# Altium project SMART_HOME_FINAL.PrjPcb
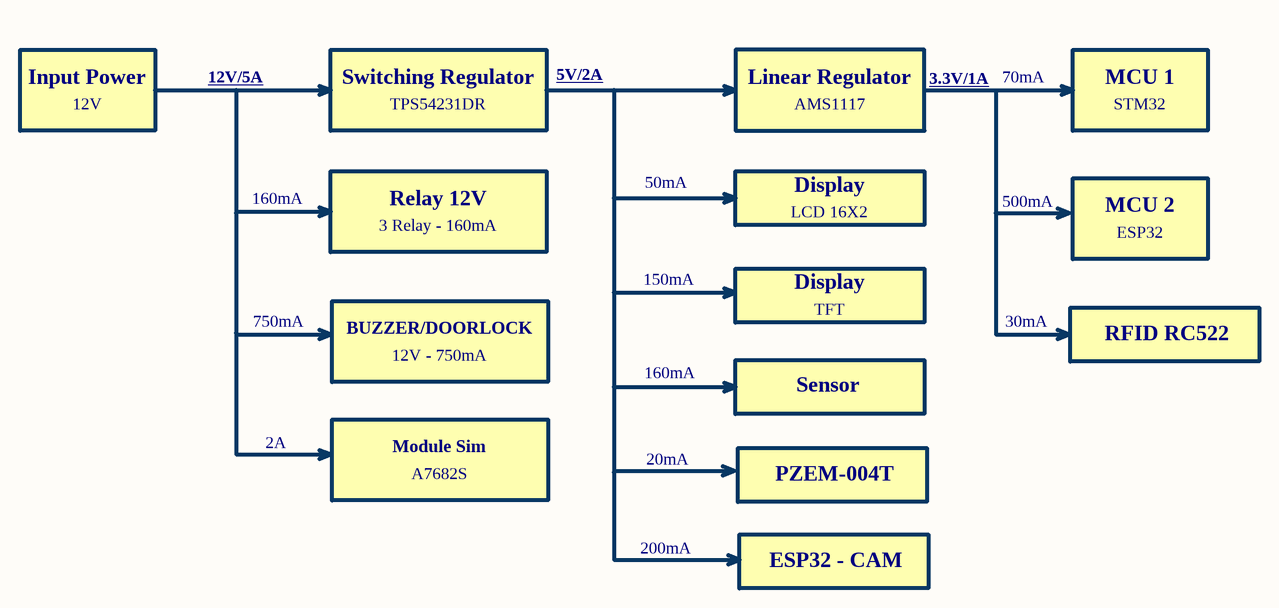
[diagram p0: POWER DIAGRAM.SchDoc]
5 sheets, 146 parts. Net scope: global (net labels, ports and power ports of the same name join across sheets).
Board file: BOARD.PcbDoc
Sheets:
  POWER DIAGRAM.SchDoc
  POWER SUPPLY.SchDoc
  BLOCK DIAGRAM.SchDoc
  MCU.SchDoc
  DEVICE.SchDoc

## Sheet POWER DIAGRAM.SchDoc
size A3; SheetNumber: 1; SheetTotal: 5

### Notes on the sheet
- Input Power
- 12V/5A
- Switching Regulator
- 5V/2A
- Linear Regulator
- 3.3V/1A
- 70mA
- MCU 1
- 12V
- TPS54231DR
- AMS1117
- STM32
- 160mA
- Relay 12V
- 3 Relay - 160mA
- 50mA
- Display
- LCD 16X2
- 500mA
- MCU 2
- ESP32
- 150mA
- 750mA
- BUZZER/DOORLOCK
- 12V - 750mA
- TFT
- 30mA
- RFID RC522
- Sensor
- 2A
- Module Sim
- A7682S
- 20mA
- PZEM-004T
- 200mA
- ESP32 - CAM

## Sheet POWER SUPPLY.SchDoc
size A3; SheetNumber: 2; SheetTotal: 5
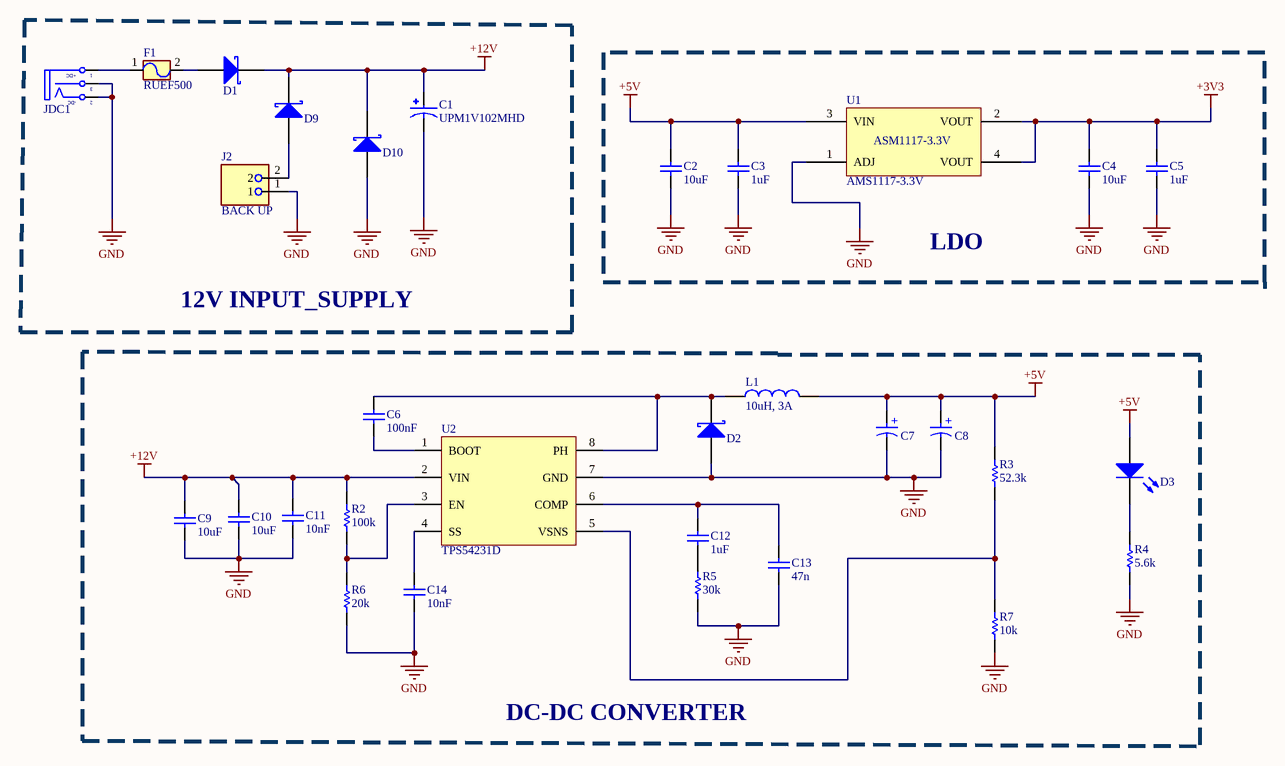
[diagram p1: POWER SUPPLY.SchDoc]

### Parts
C1  UPM1V102MHD  [CAPPRD500W80D1250H3350]
C2  10uF  [CAP_0603]
C3  1uF  [CAP_0603]
C4  10uF  [CAP_0603]
C5  1uF  [CAP_0603]
C6  100nF  [CAP_0603]
C7  47uF  [WCAP-ASLI_D5H5.5]  (value not drawn)
C8  47uF  [WCAP-ASLI_D5H5.5]  (value not drawn)
C9  10uF  [CAP_0603]
C10  10uF  [CAP_0603]
C11  10nF  [CAP_0603]
C12  1uF  [CAP_0603]
C13  47n  [CAP_0603]
C14  10nF  [CAP_0603]
D1  D Schottky  [SS34]  (value not drawn)
D2  D Schottky  [SS34]  (value not drawn)
D3  LED SMD  [LED_0805_Blue]  (value not drawn)
D9  D Schottky  [SS34]  (value not drawn)
D10  D Schottky  [SS34]  (value not drawn)
F1  RUEF500  [RUEF400]
J2  BACK UP  [PHOENIX_1935161]
JDC1  Jack DC  [DC-IN]  (value not drawn)
L1  10uH, 3A  [WE-PD2A_5848]
R2  100k  [resistor_0603]
R3  52.3k  [resistor_0603]
R4  5.6k  [resistor_0603]
R5  30k  [resistor_0603]
R6  20k  [resistor_0603]
R7  10k  [resistor_0603]
U1  AMS1117-3.3V  [AMS1117-3.3V SOT223]
U2  TPS54231D  [SOIC8]

### Blocks framed on the sheet
12V INPUT_SUPPLY: C1 D1 D9 D10 F1 J2 JDC1
DC-DC CONVERTER: C6-C14 D2 D3 L1 R2-R7 U2

### Nets
+3V3: C4.2 C5.2 U1.2(VOUT) U1.4(VOUT)
+5V: C2.2 C3.2 C7.1(P) C8.1(P) D3.1(A) L1.2 R3.2 U1.3(VIN)
+12V: C1.P C9.2 C10.2 C11.2 D1.2(K) D9.2(K) D10.2(K) R2.2 U2.2(VIN)
GND: C1.N C2.1 C3.1 C4.1 C5.1 C7.2(N) C8.2(N) C9.1 C10.1 C11.1 C13.1 C14.1 D2.1(A) D10.1(A) J2.1 JDC1.2(TN) JDC1.3(S) R4.1 R5.1 R6.1 R7.1 U1.1(ADJ) U2.7(GND)
NetC6_1: C6.1 U2.1(BOOT)
NetC6_2: C6.2 D2.2(K) L1.1 U2.8(PH)
NetC12_1: C12.1 C13.2 U2.6(COMP)
NetC12_2: C12.2 R5.2
NetC14_2: C14.2 U2.4(SS)
NetD1_1: D1.1(A) F1.2
NetD3_2: D3.2(K) R4.2
NetD9_1: D9.1(A) J2.2
NetF1_1: F1.1 JDC1.1(T)
NetR2_1: R2.1 R6.2 U2.3(EN)
NetR3_1: R3.1 R7.2 U2.5(VSNS)

### Notes on the sheet
- LDO
- Title:
- Desc:
- Designed by:
- Checked by:
- Date:
- Document No:
- Revision:
- Size:
- A3
- Approved by:
- Sheet
- of
- (in symbol 865080342006) +
- (in symbol AMS1117-3.3V) ASM1117-3.3V
- (in symbol Jack DC) +DC; -DC

### Library data of the parts
C1 = UPM1V102MHD: CAPACITOR ALUM ELECT 1000UF, 35V, RADIAL; Capacitance:1000ÂµF; Capacitance Tolerance:Â± 20%; Voltage Rating:35V; Life Time @ Temperature:5000 hours @ 105Â°C; Height:31.5mm; Diameter:12.5mm; Capacitor Mounting:Through Hole; MF: Nichicon; Purchase-URL: https://pricing.snapeda.com/search/part/UPM1V102MHD/?ref=eda; Package: Radial Nichicon; Availability: Warning; Value: *; MP: UPM1V102MHD; Price: None; SnapEDA_Link: https://www.snapeda.com/parts/UPM1V102MHD/Nichicon/view-part/775133/?ref=snap; Check_prices: https://www.snapeda.com/parts/UPM1V102MHD/Nichicon/view-part/775133/?ref=eda
C2 C4 C12 = 01060310510: CAP, size 0603, 1uF; Supply 1 SN: 885012206126; Supply 1 name: Wurth Elektronik; Supply 2 name: Thegioiic; Capacitance Tolerance: +/-10%; ComponentLink1Description: Manufacturer; ComponentLink1URL: http://www.we-online.de; ComponentLink2Description: Datasheet; ComponentLink2URL: https://www.we-online.com/components/products/datasheet/885012206126.pdf; Operating Temperature: -55 to +125degC; Packaging: Tape and Reel; Supply 1 URL: https://www.we-online.com/en/components/products/WCAP-CSGP-50VDC?sq=885012206126#885012206126; Supply 2 SN: *; Supply 2 URL: https://www.thegioiic.com/tu-gom-0603-1uf-50v; Dissipation Factor: *; Height: *; Mounting Technology: SMT; Size: 0603; Capacitance: 1uF; Technical Reference: *
C3 C5 C6 = 01060310410: CAP, size 0603, 100nF; Supply 1 SN: 885012206095; Supply 1 name: Wurth Elektronik; Supply 2 name: Thegioiic; Capacitance Tolerance: +/-10%; ComponentLink1Description: Manufacturer; ComponentLink1URL: http://www.we-online.de; ComponentLink2Description: Datasheet; ComponentLink2URL: https://www.we-online.com/catalog/datasheet/885012206095.pdf; Operating Temperature: -55 to +125degC; Packaging: Tape and Reel; Supply 1 URL: https://www.we-online.com/en/components/products/WCAP-CSGP-50VDC?sq=885012206095R#885012206095R; Supply 2 SN: *; Supply 2 URL: https://www.thegioiic.com/tu-gom-0603-100nf-0-1uf-50v; Dissipation Factor: *; Height: *; Mounting Technology: SMT; Size: 0603; Capacitance: 100nF; Technical Reference: *
C7 C8 = 865080342006: V-Chip, D5 x H5.5mm, 47uF, 16V; Capacitance Tolerance: +/-20%; Dissipation Factor: 16%; Endurance: 2000h; Leakage Current: 7.52uA; Ripple Current: 195mA; Supply 1 Name: Mouser; Supply 1 SN: 710-865080262015; Supply 2 Name: thegioiic; Category: Aluminum Electrolytic Capacitors; ComponentLink2Description: Datasheet Link; ComponentLink2URL: https://www.we-online.com/redexpert/spec/865080342006?ad; Mount: Surface Mount; Operating Temperature Max: 105°C; Operating Temperature Min: -55°C; Packaging: Tape and Reel; Height: 5.5mm; Diameter: 5mm; Capacitance: 47uF; Rated Voltage (DC): 16V; Supply 1 URL: https://www.mouser.com/ProductDetail/Wurth-Elektronik/865080262015?qs=0KOYDY2FL2%2Ffe5w2MssUoQ%3D%3D; Supply 2 URL: https://www.thegioiic.com/tu-nhom-smd-47uf-16v-5x5-4mm
C9 C10 = 01060310010: CAP, size 0603,10uF; Supply 2 name: Thegioiic; Capacitance Tolerance: +/-10%; ComponentLink1Description: Manufacturer; ComponentLink1URL: *; ComponentLink2Description: Datasheet; ComponentLink2URL: *; Operating Temperature: -55 to +125degC; Packaging: Tape and Reel; Supply 1 SN: *; Supply 1 name: *; Supply 1 URL: *; Supply 2 SN: *; Supply 2 URL: https://www.thegioiic.com/tu-gom-0603-10uf-16v; Dissipation Factor: *; Height: *; Mounting Technology: SMT; Size: 0603; Capacitance: 10uF; Technical Reference: *
C11 C14 = 01060310310: CAP, size 0603, 10nF; Supply 1 SN: 885012206089; Supply 1 name: Wurth Elektronik; Supply 2 name: Thegioiic; Capacitance Tolerance: +/-10%; ComponentLink1Description: Manufacturer; ComponentLink1URL: http://www.we-online.de; ComponentLink2Description: Datasheet; ComponentLink2URL: https://www.we-online.com/catalog/datasheet/885012206089.pdf; Operating Temperature: -55 to +125degC; Packaging: Tape and Reel; Supply 1 URL: https://www.we-online.com/en/components/products/WCAP-CSGP-50VDC?sq=885012206089#885012206089; Supply 2 SN: *; Supply 2 URL: https://www.thegioiic.com/tu-gom-0603-10nf-50v; Dissipation Factor: *; Height: *; Mounting Technology: SMT; Size: 0603; Capacitance: 10nF; Technical Reference: *
C13 = 01060347310: CAP, size 0603, 47nF; Supply 1 SN: 885012206093; Supply 1 name: Wurth Elektronik; Supply 2 name: Thegioiic; Capacitance Tolerance: +/-10%; ComponentLink1Description: Manufacturer; ComponentLink1URL: http://www.we-online.de; ComponentLink2Description: Datasheet; ComponentLink2URL: https://www.we-online.com/catalog/datasheet/885012206093.pdf; Operating Temperature: -55 to +125degC; Packaging: Tape and Reel; Supply 1 URL: https://www.we-online.com/en/components/products/WCAP-CSGP-50VDC?sq=885012206093#885012206093; Supply 2 SN: *; Supply 2 URL: https://www.thegioiic.com/tu-gom-0603-47nf-50v; Dissipation Factor: *; Height: *; Mounting Technology: SMT; Size: 0603; Capacitance: 47nF; Technical Reference: *
D1 D9 D10 = D Schottky: Schottky Diode SS54A; Published: 8-Jun-2000; LatestRevisionDate: 17-Jul-2002; LatestRevisionNote: Re-released for DXP Platform.; PackageReference: SMB; Publisher: Altium Limited; PackageDescription: DO-214-AA/SMB; 2 C-Bend Leads; Body 5.3 x 3.6 mm, inc. leads (LxW); Code_JEDEC: DO-214-AA
D2 = D Schottky: Schottky Diode; Published: 8-Jun-2000; LatestRevisionDate: 17-Jul-2002; LatestRevisionNote: Re-released for DXP Platform.; PackageReference: SMB; Publisher: Altium Limited; PackageDescription: DO-214-AA/SMB; 2 C-Bend Leads; Body 5.3 x 3.6 mm, inc. leads (LxW); Code_JEDEC: DO-214-AA
D3 = LED SMD: LED
F1 = RUEF500: Polymeric PTC Resettable Fuse 30V 5 A Ih Through Hole Radial, Disc; MF: Littelfuse; SnapEDA_Link: https://www.snapeda.com/parts/RUEF500/Littelfuse/view-part/?ref=snap; Package: Radial Littelfuse; Value: *; MP: RUEF500; Check_prices: https://www.snapeda.com/parts/RUEF500/Littelfuse/view-part/?ref=eda
J2 = Domino: PCB Terminal Screw 5mm 16AWG 400V 17.5A 2 Position COMBICON PT Series | Phoenix Contact 1935161; SnapEDA_Link: https://www.snapeda.com/parts/1935161/Phoenix+Contact/view-part/?ref=snap; Package: None; Value: *; MF: Phoenix Contact; MP: 1935161; Check_prices: https://www.snapeda.com/parts/1935161/Phoenix+Contact/view-part/?ref=eda
JDC1 = Jack DC: Jack DC input; Value: Jac DC
L1 = 78477410: WE-PD2A SMT Power Inductor, size 5848, 10uH, 2.2A; Manufacturer: Wurth Elektronik; DC Resistance max.: 0.1Ohm; Saturation Current: 2.5A; Self Resonant Frequency: 26MHz; DC Resistance typ.: 0.078Ohm; Rated Voltage: 80VDC; Supply 1 Name: Digi-Key; Supply 1 SN: 732-6830-2-ND; Supply 2 Name: Mouser; Supply 2 SN: 710-78477410; Supply 3 Name: thegioiic; ComponentLink1Description: Manufacturer; ComponentLink1URL: http://www.we-online.de; ComponentLink2Description: Datasheet; ComponentLink2URL: https://www.we-online.com/catalog/datasheet/78477410.pdf; Manufacturer Part Number: 78477410; Published Date: May 2020; Rated Current: 2.2A; Inductance: 10uH; Operating Temperature: -40 to +125degC; Mounting Technology: SMT; Packaging: Tape and Reel; Size: 5848; Supply 1 URL: https://www.digikey.com/en/products/detail/w%C3%BCrth-elektronik/78477410/5168779?s=N4IgTCBcDaIOwA4Asc5IIwAYQF0C%2BQA; Supply 2 URL: https://www.mouser.vn/ProductDetail/Wurth-Elektronik/78477410?qs=sBf%2Fb4nBSldlX6CYaJExDg%3D%3D; Supply 3 URL: https://www.thegioiic.com/cuon-cam-dan-smd-cd53-5852-100-10uh-1-8a
R2 = 0006031041: RES, 100k Ohm, size 0603, 1%; Resistance Tolerant: +/-1%; Rated Power: 1/4W; Supply 1 Name: Mouser; Supply 1 SN: 603-SR0603FR-7T100KL; Supply 2 Name: Digikey; Supply 2 SN: YAG5821TR-ND YAG5821CT-ND YAG5821DKR-ND; Resistance: 100k; Size: 0603; Mounting Technology: SMT; ComponentLink1Description: Datasheet link; ComponentLink1URL: https://www.yageo.com/upload/media/product/productsearch/datasheet/rchip/PYu-SR_20105_RoHS_L_10.pdf; ComponentLink2Description: Supply 1 URL; ComponentLink2URL: https://www.mouser.vn/ProductDetail/YAGEO/SR0603FR-7T100KL?qs=sGAEpiMZZMvdGkrng054tz1y1XEHv7sNa%252BA%2F4WiDMf7aGw4zRBb%2FFQ%3D%3D; ComponentLink3Description: Supply 2 URL; ComponentLink3URL: https://www.digikey.com/en/products/detail/yageo/SR0603FR-7T100KL/9373095
R3 = 0006038251: RES, 52.3 kOhms, size 0603, 1%; Resistance tolerance: +/-1%; Rated Power: 1/4 W; Resistance: 8.2K; Supply 1 Name: Mouser; Supply 1 SN: 660-HV731JTTD8204F; Supply 2 Name: Digi-Key; Supply 2 SN: 13-RC0603FR-078M2LTR-ND; Size: 0603; Mounting Technology: SMT; ComponentLink1Description: Datasheet link; ComponentLink1URL: *; Supply 1 URL: https://www.mouser.vn/ProductDetail/KOA-Speer/HV731JTTD8204F?qs=ZqVPfSd1khqN0teaqWW7DA%3D%3D; Supply 2 URL: https://www.digikey.com/en/products/detail/yageo/RC0603FR-078M2L/5918418; Supply 3 Name: *; Supply 3 SN: *
R4 = 0006035621: RES, 5.6k Ohm, size 0603, 1%; Resistance Tolerant: +/-1%; Rated Power: 1/4W; Supply 1 Name: Mouser; Supply 1 SN: 667-ERJ-UP3F5601V; Supply 2 Name: Digikey; Supply 2 SN: 10-ERJ-UP3F5601VTR-ND 10-ERJ-UP3F5601VCT-ND 10-ERJ-UP3F5601VDKR-ND; Resistance: 5.6k; Size: 0603; Mounting Technology: SMT; ComponentLink1Description: Datasheet link; ComponentLink1URL: https://api.pim.na.industrial.panasonic.com/file_stream/main/fileversion/4484; ComponentLink2Description: Supply 1 URL; ComponentLink2URL: https://www.mouser.vn/ProductDetail/Panasonic/ERJ-UP3F5601V?qs=sGAEpiMZZMvdGkrng054twq3eZrCFN89ezYxgAsnxBTZYD17cS%252B65A%3D%3D; ComponentLink3Description: Supply 2 URL; ComponentLink3URL: https://www.digikey.com/en/products/detail/panasonic-electronic-components/ERJ-UP3F5601V/12092890
R5 = 0006033205: RES, 30k Ohm, size 0603, 1%; Resistance tolerance: +/-1%; Rated Power: 1/4 W; Size: 0603; Mounting Technology: SMT; Datasheet: *; Resistance: 30k; ComponentLink1Description: Datasheet link; ComponentLink1URL: *; Supply 1 Name: *; Supply 1 SN: *; Supply 1 URL: *; Supply 2 Name: *; Supply 2 SN: *; Supply 2 URL: *; Supply 3 Name: *; Supply 3 SN: *; Supply 3 URL: *; Manufacture  Name: *; Manufacture  SN: *
R6 = 0006032031: RES, 20 kOhms, size 0603, 1%; Resistance tolerance: +/-1%; Rated Power: 1/4 W; Supply 1 Name: Mouser; Supply 1 SN: 667-ERJ-S03F2002V; Supply 2 Name: Digi-Key; Supply 2 SN: 13-RC0603FR-1320KLTR-ND; Size: 0603; Mounting Technology: SMT; Resistance: 20 k; ComponentLink1Description: Datasheet link; ComponentLink1URL: *; Supply 1 URL: https://www.mouser.vn/ProductDetail/Panasonic/ERJ-S03F2002V?qs=Zyl8A9hlmJopfTdqNIDujw%3D%3D; Supply 2 URL: https://www.digikey.com/en/products/detail/yageo/RC0603FR-1320KL/13694225; Supply 3 Name: *; Supply 3 SN: *
R7 = 0006031521: RES, 1.5 kOhms, size 0603, 1%; Resistance tolerance: +/-1%; Rated Power: 1/4 W; Resistance: 1.5 k; Supply 1 Name: Mouser; Supply 1 SN: 755-SFR03EZPF1501; Supply 2 Name: Digi-Key; Supply 2 SN: 13-RC0603FR-071R5LTR-ND; Size: 0603; Mounting Technology: SMT; ComponentLink1Description: Datasheet link; ComponentLink1URL: *; Supply 1 URL: https://www.mouser.vn/ProductDetail/ROHM-Semiconductor/SFR03EZPF1501?qs=byeeYqUIh0NryWvnzlukLQ%3D%3D; Supply 2 URL: https://www.digikey.com/en/products/detail/yageo/RC0603FR-071R5L/5918292; Supply 3 Name: *; Supply 3 SN: *
U1 = AMS1117-3.3V: AMS1117-3.3V, OUT 3.3V 1A.; Manufacturer: AMS; Pad Count: 4; Current Output Maximum: 1A; Voltage Input Maximum: 15V; Manufacturer Part Number: *; Part Number: *; Current Input Maximum: *; Supplier 1 Link: *; Supplier 1 Name: *; Supplier 2 Link: *; Supplier 2 Name: *; Supplier 2 Part Number: *; Supplier 3 Link: https://www.thegioiic.com/ams1117-3-3v-ic-on-ap-3-3v-1a-sot-223; Supplier 3 Name: ThegioiIC; Supplier 3 Part Number: *; Voltage Output: 3.3V; Mounting Technology: SMD; Supplier 1 Part Number: *; Datasheet: http://www.advanced-monolithic.com/pdf/ds1117.pdf
U2 = TPS54231: Buck Switching Regulator IC Positive Adjustable 0.8V 1 Output 2A 8-SOIC (0.154", 3.90mm Width); Mfr: Texas Instruments; Function: Step-Down; Number of Outputs: 1; Voltage - Input (Min): 3.5V; Voltage - Input (Max): 28V; Voltage - Output (Max): 25V; Frequency - Switching: 570kHz; Category: Integrated Circuits (ICs); Output Configuration: Positive; Topology: Buck; Output Type: Adjustable; Voltage - Output (Min/Fixed): 0.8V; Current - Output: 2A; Operating Temperature: -40°C ~ 150°C (TJ); Mounting Type: Surface Mount; ComponentLink1Description: Thegioiic; ComponentLink1URL: https://www.thegioiic.com/tps54231dr-ic-dieu-chinh-giam-ap-2a-8-soic; ComponentLink2Description: Datasheet; ComponentLink2URL: https://www.ti.com/lit/ds/symlink/tps54231.pdf

## Sheet BLOCK DIAGRAM.SchDoc
size A3; SheetNumber: 3; SheetTotal: 5
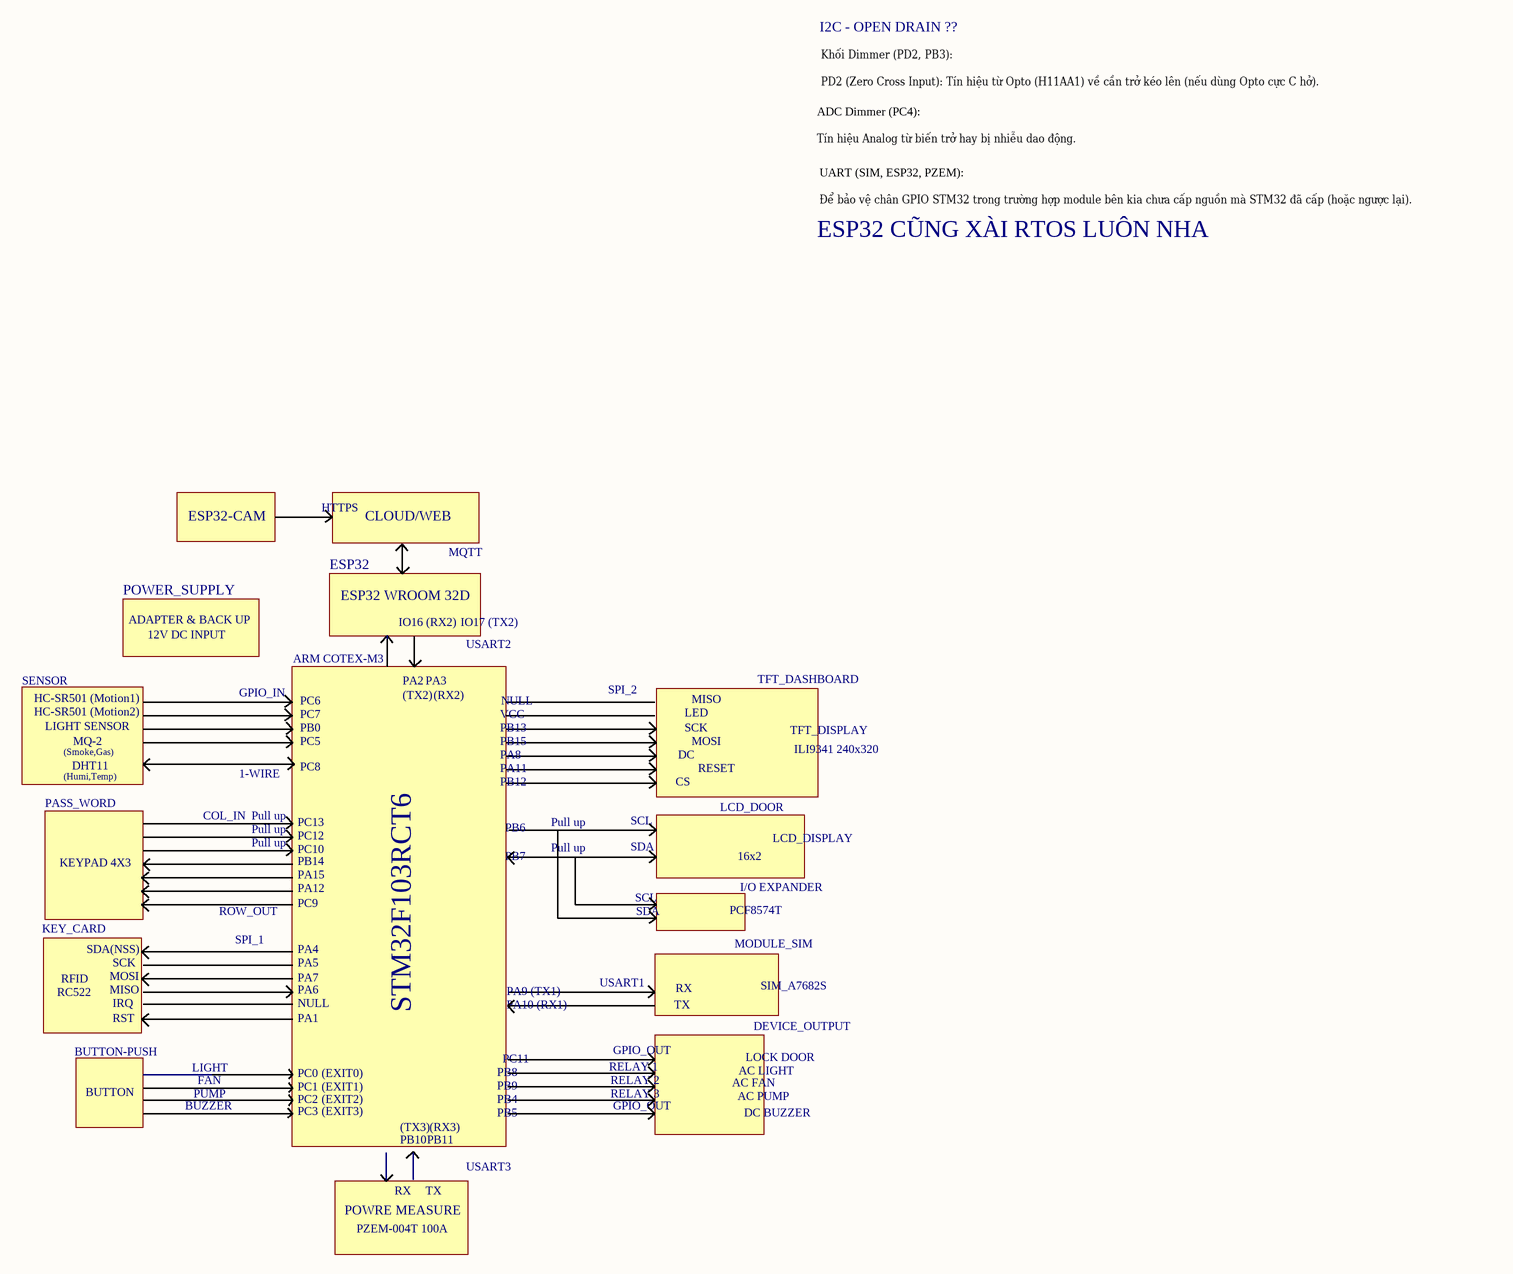
[diagram p2: BLOCK DIAGRAM.SchDoc]

### Notes on the sheet
- I2C - OPEN DRAIN ??
- Khối Dimmer (PD2, PB3):
  PD2 (Zero Cross Input): Tín hiệu từ Opto (H11AA1) về cần trở kéo lên (nếu dùng Opto cực C hở). 👉 Thêm trở 10kΩ kéo lên 3.3V.
  PB3 (Triac Output): Kích vào Opto triac (MOC3021). 👉 Thêm trở hạn dòng 330Ω - 470Ω nối tiếp.
- ADC Dimmer (PC4):
  Tín hiệu Analog từ biến trở hay bị nhiễu dao động.
  👉 Thêm: 1 tụ gốm 100nF nối từ chân PC4 xuống GND (ngay sát chân chip) để làm mượt giá trị đọc.
- ESP32 CŨNG XÀI RTOS LUÔN NHA
- UART (SIM, ESP32, PZEM):
  Để bảo vệ chân GPIO STM32 trong trường hợp module bên kia chưa cấp nguồn mà STM32 đã cấp (hoặc ngược lại).
  👉 Thêm: Mắc nối tiếp điện trở 1kΩ trên các đường TX và RX. (Ví dụ: STM32_TX --[1k]-- ESP32_RX).
- ESP32-CAM
- HTTPS
- CLOUD/WEB
- POWER_SUPPLY
- ESP32
- ESP32 WROOM 32D
- MQTT
- ADAPTER & BACK UP
- 12V DC INPUT
- ARM COTEX-M3
- IO16 (RX2)
- IO17 (TX2)
- USART2
- SENSOR
- HC-SR501 (Motion1)
- HC-SR501 (Motion2)
- LIGHT SENSOR
- GPIO_IN
- PC6
- PC7
- PB0
- PA2
- (TX2)
- PA3
- (RX2)
- PB13
- VCC
- NULL
- SPI_2
- SCK
- LED
- MISO
- TFT_DASHBOARD
- TFT_DISPLAY
- (Humi,Temp)
- (Smoke,Gas)
- DHT11
- MQ-2
- 1-WIRE
- PC5
- PC8
- PB12
- PA11
- PA8
- PB15
- CS
- DC
- MOSI
- RESET
- ILI9341 240x320
- PASS_WORD
- KEYPAD 4X3
- COL_IN
- Pull up
- PC13
- PC12
- PC10
- PB14
- PB6
- PB7
- SCL
- SDA
- LCD_DOOR
- 16x2
- LCD_DISPLAY
- KEY_CARD
- ROW_OUT
- PA15
- PA12
- PC9
- PCF8574T
- I/O EXPANDER
- RC522
- RFID
- SDA(NSS)
- IRQ
- SPI_1
- PA5
- PA4
- PA7
- PA6
- STM32F103RCT6
- PA9 (TX1)
- PA10 (RX1)
- USART1
- TX
- RX
- MODULE_SIM
- SIM_A7682S
- BUTTON-PUSH
- RST
- LIGHT
- PA1
- PC11
- RELAY 1
- GPIO_OUT
- AC LIGHT
- LOCK DOOR
- DEVICE_OUTPUT
- BUTTON
- BUZZER
- PUMP
- FAN
- PC0
- PC1
- PC2
- PC3
- (EXIT0)
- (EXIT1)
- (EXIT2)
- (EXIT3)
- PB10
- (TX3)
- PB11
- (RX3)
- PB8
- PB9
- PB4
- PB5
- RELAY 2
- RELAY 3
- AC FAN
- AC PUMP
- DC BUZZER
- USART3
- POWRE MEASURE
- PZEM-004T 100A
- Title:
- Desc:
- Designed by:
- Checked by:
- Date:
- Document No:
- Revision:
- Size:
- A3
- Approved by:
- Sheet
- of

## Sheet MCU.SchDoc: SMART_HOME
size A3; DrawnBy: Le Viet Trong; SheetNumber: 4; SheetTotal: 5
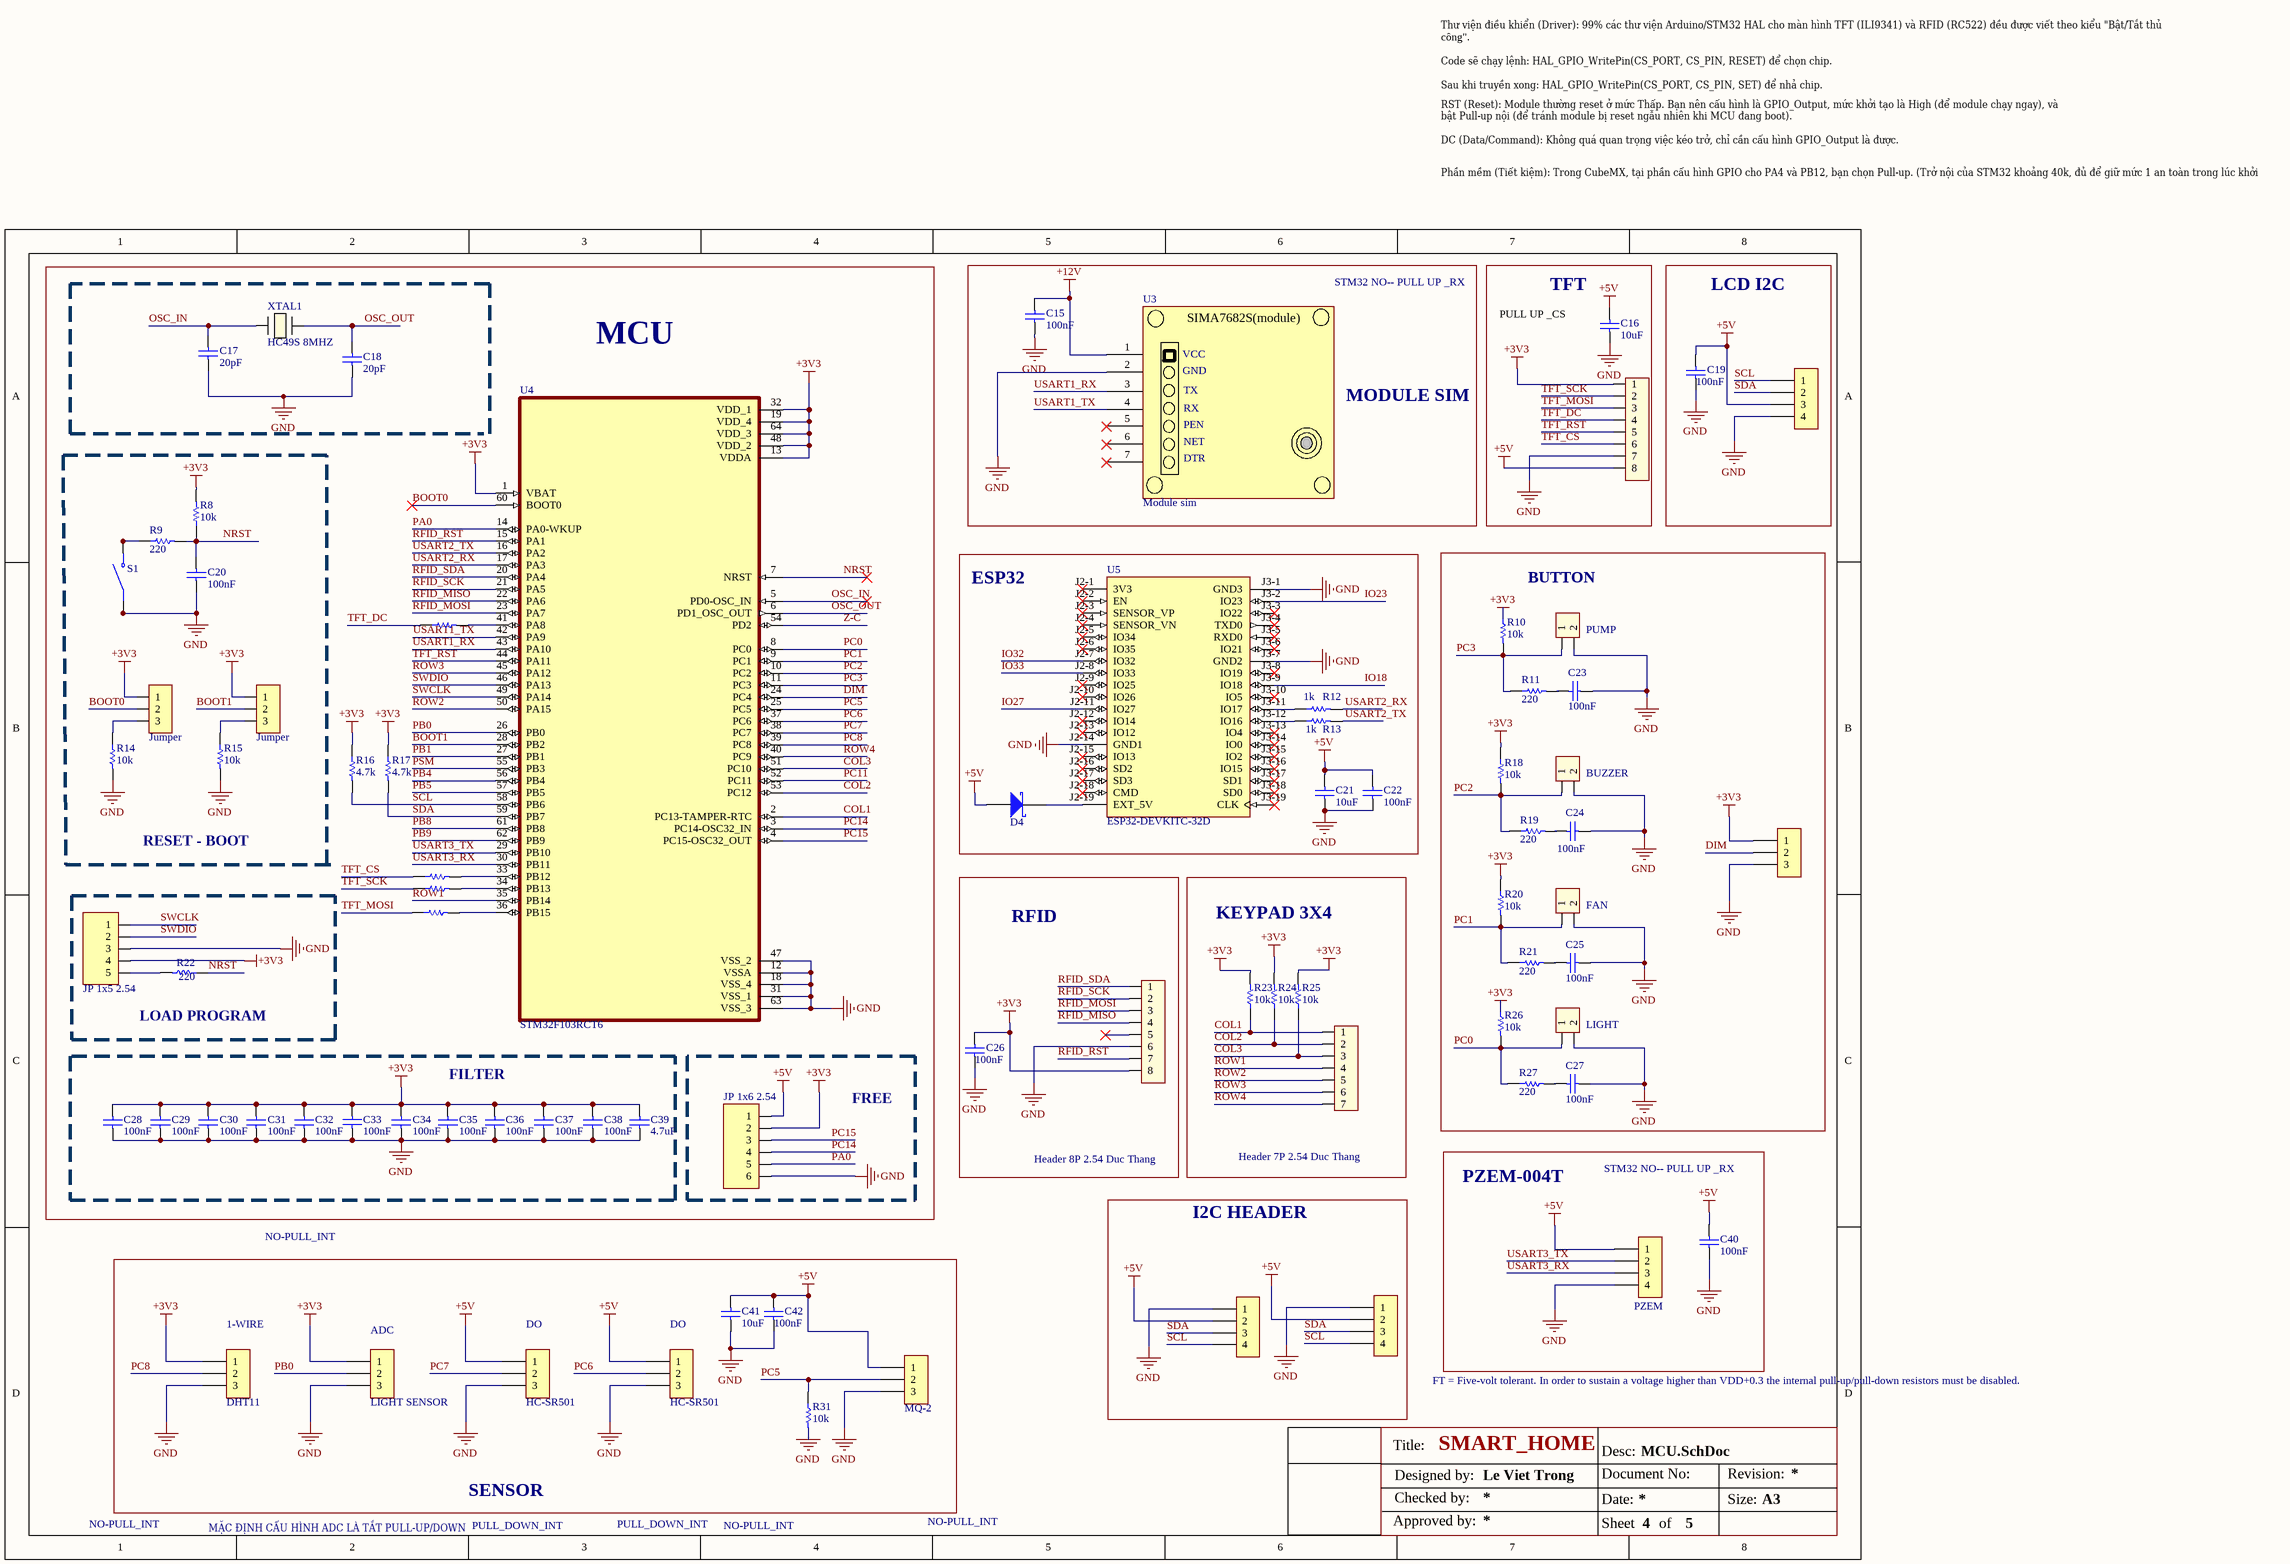
[diagram p3: MCU.SchDoc]

### Parts
C15  100nF  [CAP_0603]
C16  10uF  [CAP_0603]
C17  20pF  [CAP_0603]
C18  20pF  [CAP_0603]
C19  100nF  [CAP_0603]
C20  100nF  [CAP_0603]
C21  10uF  [CAP_0603]
C22  100nF  [CAP_0603]
C23  100nF  [CAP_0603]
C24  100nF  [CAP_0603]
C25  100nF  [CAP_0603]
C26  100nF  [CAP_0603]
C27  100nF  [CAP_0603]
C28  100nF  [CAP_0603]
C29  100nF  [CAP_0603]
C30  100nF  [CAP_0603]
C31  100nF  [CAP_0603]
C32  100nF  [CAP_0603]
C33  100nF  [CAP_0603]
C34  100nF  [CAP_0603]
C35  100nF  [CAP_0603]
C36  100nF  [CAP_0603]
C37  100nF  [CAP_0603]
C38  100nF  [CAP_0603]
C39  4.7uF  [CAP_0603]
C40  100nF  [CAP_0603]
C41  10uF  [CAP_0603]
C42  100nF  [CAP_0603]
D4  D Schottky  [SS34]  (value not drawn)
H1  Header 4P 2.54 Duc Thang  [XH2.54M-4]  (value not drawn)
H2  Header 8P 2.54 Duc Thang  [XH2.54M-8]  (value not drawn)
H3  PUMP  [XH2.54M-2]
H4  BUZZER  [XH2.54M-2]
H5  (no value)  [XH2.54M-3]
H6  FAN  [XH2.54M-2]
H7  Header 8P 2.54 Duc Thang  [XH2.54M-8]
H8  Header 7P 2.54 Duc Thang  [XH2.54M-7]
H9  LIGHT  [XH2.54M-2]
H10  PZEM  [XH2.54M-4]
H11  Header 4P 2.54 Duc Thang  [XH2.54M-4]  (value not drawn)
H12  Header 4P 2.54 Duc Thang  [XH2.54M-4]  (value not drawn)
H13  DHT11  [XH2.54M-3]
H14  LIGHT SENSOR  [XH2.54M-3]
H15  HC-SR501  [XH2.54M-3]
H16  HC-SR501  [XH2.54M-3]
H17  MQ-2  [XH2.54M-3]
JP1  Jumper  [JP 1x3 DT]
JP2  Jumper  [JP 1x3 DT]
JP3  JP 1x5 2.54  [JP 1X5 DT]
JP4  JP 1x6 2.54  [JP 1x6 DT]
R1  22  [resistor_0603]  (value not drawn)
R8  10k  [resistor_0603]
R9  220  [resistor_0603]
R10  10k  [resistor_0603]
R11  220  [resistor_0603]
R12  1k  [resistor_0603]
R13  1k  [resistor_0603]
R14  10k  [resistor_0603]
R15  10k  [resistor_0603]
R16  4.7k  [resistor_0603]
R17  4.7k  [resistor_0603]
R18  10k  [resistor_0603]
R19  220  [resistor_0603]
R20  10k  [resistor_0603]
R21  220  [resistor_0603]
R22  220  [resistor_0603]
R23  10k  [resistor_0603]
R24  10k  [resistor_0603]
R25  10k  [resistor_0603]
R26  10k  [resistor_0603]
R27  220  [resistor_0603]
R31  10k  [resistor_0603]
R43  22  [resistor_0603]  (value not drawn)
R44  22  [resistor_0603]  (value not drawn)
R45  22  [resistor_0603]  (value not drawn)
S1  Button SMD  [BUTTON]  (value not drawn)
U3  Module sim  [MODULESIM_NEW]
U4  STM32F103RCT6  [QFP50P1200X1200X160-64N]
U5  ESP32-DEVKITC-32D  [MODULE_ESP32-DEVKITC-32D]
XTAL1  HC49S 8MHZ  [XTAL_HC49S_MTC]

### Blocks framed on the sheet
MCU: C17 C18 R1 R16 R17 R43-R45 U4 XTAL1
MODULE SIM: C15 U3
TFT: C16 H2
LCD I2C: C19 H1
RESET - BOOT: C20 JP1 JP2 R8 R9 R14 R15 S1
ESP32: C21 C22 D4 R12 R13 U5
BUTTON: C23-C25 C27 H3-H6 H9 R10 R11 R18-R21 R26 R27
LOAD PROGRAM: JP3 R22
RFID: C26 H7
KEYPAD 3X4: H8 R23-R25
FILTER: C28-C39
FREE: JP4
I2C HEADER: H11 H12
PZEM-004T: C40 H10
SENSOR: C41 C42 H13-H17 R31

### Nets
+3V3: C26.2 C28.2 C29.2 C30.2 C31.2 C32.2 C33.1 C34.2 C35.2 C36.2 C37.2 C38.2 C39.2 H2.1 H5.1 H7.8 H13.1 H14.1 JP1.1 JP2.1 JP3.4 JP4.2 R8.2 R10.1 R16.1 R17.1 R18.1 R20.1 R23.2 R24.2 R25.2 R26.1 U4.1(VBAT) U4.13(VDDA) U4.19(VDD_4) U4.32(VDD_1) U4.48(VDD_2) U4.64(VDD_3)
+5V: C16.2 C19.2 C21.2 C22.2 C40.2 C41.2 C42.2 D4.1(A) H1.3 H2.8 H10.1 H11.2 H12.2 H15.1 H16.1 H17.1 JP4.1
+12V: C15.2 U3.1(VCC)
GND: C15.1 C16.1 C17.1 C18.1 C19.1 C20.1 C21.1 C22.1 C23.2 C24.2 C25.2 C26.1 C27.2 C28.1 C29.1 C30.1 C31.1 C32.1 C33.2 C34.1 C35.1 C36.1 C37.1 C38.1 C39.1 C40.1 C41.1 C42.1 H1.4 H2.7 H3.2 H4.2 H5.3 H6.2 H7.6 H9.2 H10.4 H11.1 H12.1 H13.3 H14.3 H15.3 H16.3 H17.3 JP3.3 JP4.6 R14.2 R15.2 R31.2 S1.1(COM) S1.2(COM) U3.2(GND) U4.12(VSSA) U4.18(VSS_4) U4.31(VSS_1) U4.47(VSS_2) U4.63(VSS_3) U5.J2-14(GND1) U5.J3-1(GND3) U5.J3-7(GND2)
BOOT0: JP1.2 U4.60(BOOT0)
BOOT1: JP2.2 U4.28(PB2)
COL1: H8.1 R23.1 U4.2(PC13-TAMPER-RTC)
COL2: H8.2 R24.1 U4.53(PC12)
COL3: H8.3 R25.1 U4.51(PC10)
DIM: H5.2 U4.24(PC4)
IO18: U5.J3-9(IO18)
IO23: U5.J3-2(IO23)
IO27: U5.J2-11(IO27)
IO32: U5.J2-7(IO32)
IO33: U5.J2-8(IO33)
NRST: C20.2 R8.1 R9.2 R22.1 U4.7(NRST)
OSC_IN: C17.2 U4.5(PD0-OSC_IN) XTAL1.1
OSC_OUT: C18.2 U4.6(PD1_OSC_OUT) XTAL1.2
PA0: JP4.5 U4.14(PA0-WKUP)
PB0: H14.2 U4.26(PB0)
PB1: U4.27(PB1)
PB4: U4.56(PB4)
PB5: U4.57(PB5)
PB8: U4.61(PB8)
PB9: U4.62(PB9)
PC0: H9.1 R26.2 R27.1 U4.8(PC0)
PC1: H6.1 R20.2 R21.1 U4.9(PC1)
PC2: H4.1 R18.2 R19.1 U4.10(PC2)
PC3: H3.1 R10.2 R11.1 U4.11(PC3)
PC5: H17.2 R31.1 U4.25(PC5)
PC6: H16.2 U4.37(PC6)
PC7: H15.2 U4.38(PC7)
PC8: H13.2 U4.39(PC8)
PC11: U4.52(PC11)
PC14: JP4.4 U4.3(PC14-OSC32_IN)
PC15: JP4.3 U4.4(PC15-OSC32_OUT)
PSM: U4.55(PB3)
RFID_MISO: H7.4 U4.22(PA6)
RFID_MOSI: H7.3 U4.23(PA7)
RFID_RST: H7.7 U4.15(PA1)
RFID_SCK: H7.2 U4.21(PA5)
RFID_SDA: H7.1 U4.20(PA4)
ROW1: H8.4 U4.35(PB14)
ROW2: H8.5 U4.50(PA15)
ROW3: H8.6 U4.45(PA12)
ROW4: H8.7 U4.40(PC9)
SCL: H1.1 H11.4 H12.4 R16.2 U4.58(PB6)
SDA: H1.2 H11.3 H12.3 R17.2 U4.59(PB7)
SWCLK: JP3.1 U4.49(PA14)
SWDIO: JP3.2 U4.46(PA13)
TFT_CS: H2.6 R43.1
TFT_DC: H2.4 R1.1
TFT_MOSI: H2.3 R45.1
TFT_RST: H2.5 U4.44(PA11)
TFT_SCK: H2.2 R44.1
USART1_RX: U3.3(TX) U4.43(PA10)
USART1_TX: U3.4(RX) U4.42(PA9)
USART2_RX: R12.2 U4.17(PA3)
USART2_TX: R13.2 U4.16(PA2)
USART3_RX: H10.3 U4.30(PB11)
USART3_TX: H10.2 U4.29(PB10)
Z-C: U4.54(PD2)
NetC23_1: C23.1 R11.2
NetC24_1: C24.1 R19.2
NetC25_1: C25.1 R21.2
NetC27_1: C27.1 R27.2
NetD4_2: D4.2(K) U5.J2-19(EXT_5V)
NetJP1_3: JP1.3 R14.1
NetJP2_3: JP2.3 R15.1
NetJP3_5: JP3.5 R22.2
NetR1_2: R1.2 U4.41(PA8)
NetR9_1: R9.1 S1.3(NO) S1.4(NO)
NetR12_1: R12.1 U5.J3-11(IO17)
NetR13_1: R13.1 U5.J3-12(IO16)
NetR43_2: R43.2 U4.33(PB12)
NetR44_2: R44.2 U4.34(PB13)
NetR45_2: R45.2 U4.36(PB15)

Not connected (* = marked no-connect by the designer): H7 5*; U3 5(PEN)* 6(NET)* 7(DTR)*; U5 J2-1(3V3)* J2-2(EN)* J2-3(SENSOR_VP)* J2-4(SENSOR_VN)* J2-5(IO34)* J2-6(IO35)* J2-9(IO25)* J2-10(IO26)* J2-12(IO14)* J2-13(IO12)* J2-15(IO13)* J2-16(SD2)* J2-17(SD3)* J2-18(CMD)* J3-3(IO22)* J3-4(TXD0)* J3-5(RXD0)* J3-6(IO21)* J3-8(IO19)* J3-10(IO5)* J3-13(IO4)* J3-14(IO0)* J3-15(IO2)* J3-16(IO15)* J3-17(SD1)* J3-18(SD0)* J3-19(CLK)*

### Notes on the sheet
- Thư viện điều khiển (Driver): 99% các thư viện Arduino/STM32 HAL cho màn hình TFT (ILI9341) và RFID (RC522) đều được viết theo kiểu "Bật/Tắt thủ công".
  Code sẽ chạy lệnh: HAL_GPIO_WritePin(CS_PORT, CS_PIN, RESET) để chọn chip.
  Sau khi truyền xong: HAL_GPIO_WritePin(CS_PORT, CS_PIN, SET) để nhả chip.
  Tính linh hoạt: Hardware NSS của STM32 hoạt động khá cứng nhắc (ví dụ: nó có thể tự động ngắt CS giữa các byte truyền nếu không cấu hình đúng), điều này có thể làm ngắt quãng quá trình truyền dữ liệu liên tục (Burst Mode) mà màn hình TFT cần để vẽ nhanh.
  Cấu hình: Trong CubeMX, bạn chỉ cần set chân PA4 và PB12 là GPIO_Output. Đừng chọn chức năng SPI1_NSS hay SPI2_NSS.
- RST (Reset): Module thường reset ở mức Thấp. Bạn nên cấu hình là GPIO_Output, mức khởi tạo là High (để module chạy ngay), và bật Pull-up nội (để tránh module bị reset ngẫu nhiên khi MCU đang boot).
  DC (Data/Command): Không quá quan trọng việc kéo trở, chỉ cần cấu hình GPIO_Output là được.
- Phần mềm (Tiết kiệm): Trong CubeMX, tại phần cấu hình GPIO cho PA4 và PB12, bạn chọn Pull-up. (Trở nội của STM32 khoảng 40k, đủ để giữ mức 1 an toàn trong lúc khởi động).
- STM32 NO-- PULL UP _RX
- (near C16) PULL UP _CS
- NO-PULL_INT
- (near H13) 1-WIRE
- (near H14) ADC
- (near H15) DO
- (near H16) DO
- FT = Five-volt tolerant. In order to sustain a voltage higher than VDD+0.3 the internal pull-up/pull-down resistors must be disabled.
- MẶC ĐỊNH CẤU HÌNH ADC LÀ TẮT PULL-UP/DOWN
- PULL_DOWN_INT
- Title:
- Desc:
- Designed by:
- Checked by:
- Date:
- Document No:
- Revision:
- Size:
- A3
- Approved by:
- Sheet
- of
- (in symbol Module_A7682S_V2) SIMA7682S(module)

### Library data of the parts
C15 C19 C20 C22-C38 C40 C42 = 01060310410: as C3 on sheet POWER SUPPLY; ComponentLink1Description: Manufacturer; ComponentLink1URL: http://www.we-online.de; ComponentLink2Description: Datasheet; ComponentLink2URL: https://www.we-online.com/catalog/datasheet/885012206095.pdf; Operating Temperature: -55 to +125degC; Packaging: Tape and Reel; Supply 1 URL: https://www.we-online.com/en/components/products/WCAP-CSGP-50VDC?sq=885012206095R#885012206095R; Supply 2 SN: *; Supply 2 URL: https://www.thegioiic.com/tu-gom-0603-100nf-0-1uf-50v; Dissipation Factor: *; Height: *; Mounting Technology: SMT; Size: 0603; Capacitance: 100nF; Technical Reference: *
C16 C21 C41 = 01060310010: as C9 on sheet POWER SUPPLY; ComponentLink1Description: Manufacturer; ComponentLink1URL: *; ComponentLink2Description: Datasheet; ComponentLink2URL: *; Operating Temperature: -55 to +125degC; Packaging: Tape and Reel; Supply 1 SN: *; Supply 1 name: *; Supply 1 URL: *; Supply 2 SN: *; Supply 2 URL: https://www.thegioiic.com/tu-gom-0603-10uf-16v; Dissipation Factor: *; Height: *; Mounting Technology: SMT; Size: 0603; Capacitance: 10uF; Technical Reference: *
C17 C18 = 01060322010: CAP, size 0603, 22pF; Supply 2 name: Thegioiic; Capacitance Tolerance: +/-10%; ComponentLink1Description: Manufacturer; ComponentLink1URL: Thegioiic; ComponentLink2Description: Datasheet; ComponentLink2URL: *; Operating Temperature: -55 to +125degC; Packaging: Tape and Reel; Supply 1 SN: *; Supply 1 name: *; Supply 1 URL: *; Supply 2 SN: *; Supply 2 URL: https://www.thegioiic.com/tu-gom-0603-22pf-50v; *: *; Height: *; Mounting Technology: SMT; Size: 0603; Capacitance: 22pF; Technical Reference: *
C39 = 01060310510: as C2 on sheet POWER SUPPLY; ComponentLink1Description: Manufacturer; ComponentLink1URL: http://www.we-online.de; ComponentLink2Description: Datasheet; ComponentLink2URL: https://www.we-online.com/components/products/datasheet/885012206126.pdf; Operating Temperature: -55 to +125degC; Packaging: Tape and Reel; Supply 1 URL: https://www.we-online.com/en/components/products/WCAP-CSGP-50VDC?sq=885012206126#885012206126; Supply 2 SN: *; Supply 2 URL: https://www.thegioiic.com/tu-gom-0603-1uf-50v; Dissipation Factor: *; Height: *; Mounting Technology: SMT; Size: 0603; Capacitance: 1uF; Technical Reference: *
D4 = D Schottky: SS34; Published: 8-Jun-2000; LatestRevisionDate: 17-Jul-2002; LatestRevisionNote: Re-released for DXP Platform.; PackageReference: SMB; Publisher: Altium Limited; PackageDescription: DO-214-AA/SMB; 2 C-Bend Leads; Body 5.3 x 3.6 mm, inc. leads (LxW); Code_JEDEC: DO-214-AA
H1 H10-H12 = Header 4P 2.54 Duc Thang: Cắm; Ten_Linh_Kien: Header 4P XH2.54-4P Đực Thẳng; Don_Vi: Con; Ma_Hang: MH001285; Chung_Loai: Cắm
H2 H7 = Header 8P 2.54 Duc Thang: Cắm; Ten_Linh_Kien: Header 8P XH2.54-8P Đực Thẳng; Don_Vi: Con; Ma_Hang: MH003366; Chung_Loai: Cắm
H3 = Header 2P 2.54 Duc Thang: Header 2P 2.54; Ten_Linh_Kien: Header 2P XH2.54-2P Đực Thẳng; Don_Vi: Con; Ma_Hang: MH001283; Chung_Loai: Cắm
H4 H6 H9 = Header 2P 2.54 Duc Thang: Cắm; Ten_Linh_Kien: Header 2P XH2.54-2P Đực Thẳng; Don_Vi: Con; Ma_Hang: MH001283; Chung_Loai: Cắm
H5 H13-H17 = Header 3P 2.54 Duc Thang: Cắm; Ten_Linh_Kien: Header 3P XH2.54-3P Đực Thẳng; Don_Vi: Con; Ma_Hang: MH001292; Chung_Loai: Cắm
H8 = Header 7P 2.54 Duc Thang: Cắm; Ten_Linh_Kien: Header 7P XH2.54-7P Đực Thẳng; Don_Vi: Con; Ma_Hang: MH003369; Chung_Loai: Cắm
JP1 JP2 = JP 1x3 2.54 Duc Thang: Cắm; Ten_Linh_Kien: Jump Đơn Đực 2.54MM 1x40P Thẳng 11MM; Don_Vi: Con; Ma_Hang: MH000903; Ghi_Chu: *; Kieu_Chan: *; Chung_Loai: Cắm
JP3 = JP 1x5 2.54 Duc Cong: Cắm; Ten_Linh_Kien: Jump Đơn Đực 2.54MM 1x40P Cong Đứng; Don_Vi: Con; Ma_Hang: MH000904; Ghi_Chu: *; Kieu_Chan: *; Chung_Loai: Cắm
JP4 = JP 1x6 2.54 Duc Thang: Cắm; Ten_Linh_Kien: Jump Đơn Đực 2.54MM 1x40P Thẳng 11MM; Don_Vi: Con; Ma_Hang: MH000903; Ghi_Chu: *; Kieu_Chan: *; Chung_Loai: Cắm
R1 R43-R45 = 0006031031: RES, 22 Ohm, size 0603, 1%; Resistance: 10k; Resistance Tolerant: +/-1%; Rated Power: 1/4W; Supply 1 Name: Mouser; Supply 1 SN: 755-ESR03EZPF1002; Supply 2 Name: Digikey; Supply 2 SN: RHM10KADTR-ND RHM10KADCT-ND RHM10KADDKR-ND; Size: 0603; Mounting Technology: SMT; ComponentLink1Description: Datasheet link; ComponentLink1URL: https://fscdn.rohm.com/en/products/databook/datasheet/passive/resistor/chip_resistor/esr-e.pdf; ComponentLink2Description: Supply 1 URL; ComponentLink2URL: https://www.mouser.vn/ProductDetail/ROHM-Semiconductor/ESR03EZPF1002?qs=sGAEpiMZZMvdGkrng054t67Efho1F8r6CDeAsqwFse8%3D; ComponentLink3Description: Supply 2 URL; ComponentLink3URL: https://www.digikey.com/en/products/detail/rohm-semiconductor/ESR03EZPF1002/1983429
R8 R10 R14 R15 R18 R20 R23-R26 R31 = 0006031031: RES, 10k Ohm, size 0603, 1%; Resistance Tolerant: +/-1%; Rated Power: 1/4W; Supply 1 Name: Mouser; Supply 1 SN: 755-ESR03EZPF1002; Supply 2 Name: Digikey; Supply 2 SN: RHM10KADTR-ND RHM10KADCT-ND RHM10KADDKR-ND; Resistance: 10k; Size: 0603; Mounting Technology: SMT; ComponentLink1Description: Datasheet link; ComponentLink1URL: https://fscdn.rohm.com/en/products/databook/datasheet/passive/resistor/chip_resistor/esr-e.pdf; ComponentLink2Description: Supply 1 URL; ComponentLink2URL: https://www.mouser.vn/ProductDetail/ROHM-Semiconductor/ESR03EZPF1002?qs=sGAEpiMZZMvdGkrng054t67Efho1F8r6CDeAsqwFse8%3D; ComponentLink3Description: Supply 2 URL; ComponentLink3URL: https://www.digikey.com/en/products/detail/rohm-semiconductor/ESR03EZPF1002/1983429
R9 R11 R19 R21 R27 = 0006031031: RES, 220 Ohm, size 0603, 1%; Resistance: 10k; Resistance Tolerant: +/-1%; Rated Power: 1/4W; Supply 1 Name: Mouser; Supply 1 SN: 755-ESR03EZPF1002; Supply 2 Name: Digikey; Supply 2 SN: RHM10KADTR-ND RHM10KADCT-ND RHM10KADDKR-ND; Size: 0603; Mounting Technology: SMT; ComponentLink1Description: Datasheet link; ComponentLink1URL: https://fscdn.rohm.com/en/products/databook/datasheet/passive/resistor/chip_resistor/esr-e.pdf; ComponentLink2Description: Supply 1 URL; ComponentLink2URL: https://www.mouser.vn/ProductDetail/ROHM-Semiconductor/ESR03EZPF1002?qs=sGAEpiMZZMvdGkrng054t67Efho1F8r6CDeAsqwFse8%3D; ComponentLink3Description: Supply 2 URL; ComponentLink3URL: https://www.digikey.com/en/products/detail/rohm-semiconductor/ESR03EZPF1002/1983429
R12 R13 = 0006031031: RES, 1k Ohm, size 0603, 1%; Resistance: 10k; Resistance Tolerant: +/-1%; Rated Power: 1/4W; Supply 1 Name: Mouser; Supply 1 SN: 755-ESR03EZPF1002; Supply 2 Name: Digikey; Supply 2 SN: RHM10KADTR-ND RHM10KADCT-ND RHM10KADDKR-ND; Size: 0603; Mounting Technology: SMT; ComponentLink1Description: Datasheet link; ComponentLink1URL: https://fscdn.rohm.com/en/products/databook/datasheet/passive/resistor/chip_resistor/esr-e.pdf; ComponentLink2Description: Supply 1 URL; ComponentLink2URL: https://www.mouser.vn/ProductDetail/ROHM-Semiconductor/ESR03EZPF1002?qs=sGAEpiMZZMvdGkrng054t67Efho1F8r6CDeAsqwFse8%3D; ComponentLink3Description: Supply 2 URL; ComponentLink3URL: https://www.digikey.com/en/products/detail/rohm-semiconductor/ESR03EZPF1002/1983429
R16 R17 = 0006031031: RES, 4.7k Ohm, size 0603, 1%; Resistance: 10k; Resistance Tolerant: +/-1%; Rated Power: 1/4W; Supply 1 Name: Mouser; Supply 1 SN: 755-ESR03EZPF1002; Supply 2 Name: Digikey; Supply 2 SN: RHM10KADTR-ND RHM10KADCT-ND RHM10KADDKR-ND; Size: 0603; Mounting Technology: SMT; ComponentLink1Description: Datasheet link; ComponentLink1URL: https://fscdn.rohm.com/en/products/databook/datasheet/passive/resistor/chip_resistor/esr-e.pdf; ComponentLink2Description: Supply 1 URL; ComponentLink2URL: https://www.mouser.vn/ProductDetail/ROHM-Semiconductor/ESR03EZPF1002?qs=sGAEpiMZZMvdGkrng054t67Efho1F8r6CDeAsqwFse8%3D; ComponentLink3Description: Supply 2 URL; ComponentLink3URL: https://www.digikey.com/en/products/detail/rohm-semiconductor/ESR03EZPF1002/1983429
R22 = 0006032221: RES, 330 Ohm, size 0603, 1%; Resistance: 2.2k; Resistance Tolerant: +/-1%; Rated Power: 1/4W; Supply 1 Name: Mouser; Supply 1 SN: 667-ERJ-UP3F2201V; Supply 2 Name: Digikey; Supply 2 SN: 10-ERJ-UP3F2201VTR-ND 10-ERJ-UP3F2201VCT-ND 10-ERJ-UP3F2201VDKR-ND; Supply 3 Name: thegioiic; Supply 3 SN: NA; Size: 0603; Mounting Technology: SMT; ComponentLink1Description: Datasheet link; ComponentLink1URL: https://api.pim.na.industrial.panasonic.com/file_stream/main/fileversion/4484; ComponentLink2Description: Supply 1 URL; ComponentLink2URL: https://www.mouser.vn/ProductDetail/Panasonic/ERJ-UP3F2201V?qs=sGAEpiMZZMvdGkrng054twq3eZrCFN89KeaXYJ5LTWyJgfuuVVfZrw%3D%3D; ComponentLink3Description: Supply 2 URL; ComponentLink3URL: https://www.digikey.com/en/products/detail/panasonic-electronic-components/ERJ-UP3F2201V/12092708; ComponentLink4Description: Supply 3 URL; ComponentLink4URL: https://www.thegioiic.com/dien-tro-2-2-kohm-0603-1
S1 = Button SMD: Nút Nhấn 4x4mm Cao 1.5mm 4 Chân SMD Chống Nước; MP: 8-1437565-1; Package: None; Price: None; Availability: Unavailable; Value: *
U3 = Module_A7682S_V2: Module 4G A7682S Volte Ra chân V2 TDM2431, 4.5-16V, 28×26.8×5.5mm, Mức logic I/OTTL( Serial 3.3V)
U4 = STM32F103RCT6: ARMÂ® CortexÂ®-M3 STM32F1 Microcontroller IC 32-Bit 72MHz 256KB (256K x 8) FLASH 64-LQFP (10x10); MF: STMicroelectronics; Value: *; SnapEDA_Link: https://www.snapeda.com/parts/STM32F103RCT6/STMicroelectronics/view-part/?ref=snap; MP: STM32F103RCT6; Purchase-URL: https://pricing.snapeda.com/search/part/STM32F103RCT6/?ref=eda; Check_prices: https://www.snapeda.com/parts/STM32F103RCT6/STMicroelectronics/view-part/?ref=eda; Availability: In Stock; Price: None; Package: LQFP-64 STMicroelectronics
U5 = ESP32-DEVKITC-32D: WiFi Development Tools (802.11) ESP32 General Development Kit, ESP32-WROOM-32D on the board; MF: Espressif Systems; SnapEDA_Link: https://www.snapeda.com/parts/ESP32-DEVKITC-32D/Espressif+Systems/view-part/?ref=snap; Package: None; Value: *; MP: ESP32-DEVKITC-32D; Check_prices: https://www.snapeda.com/parts/ESP32-DEVKITC-32D/Espressif+Systems/view-part/?ref=eda
XTAL1 = HC49S-12-30-50-70-30-ATF: Description; Manufacturer_Name: Multicomp; Copyright: Copyright (C) 2025 Ultra Librarian. All rights reserved.; Manufacturer_Part_Number: HC49S-12-30-50-70-30-ATF

## Sheet DEVICE.SchDoc
size A3; SheetNumber: 5; SheetTotal: 5
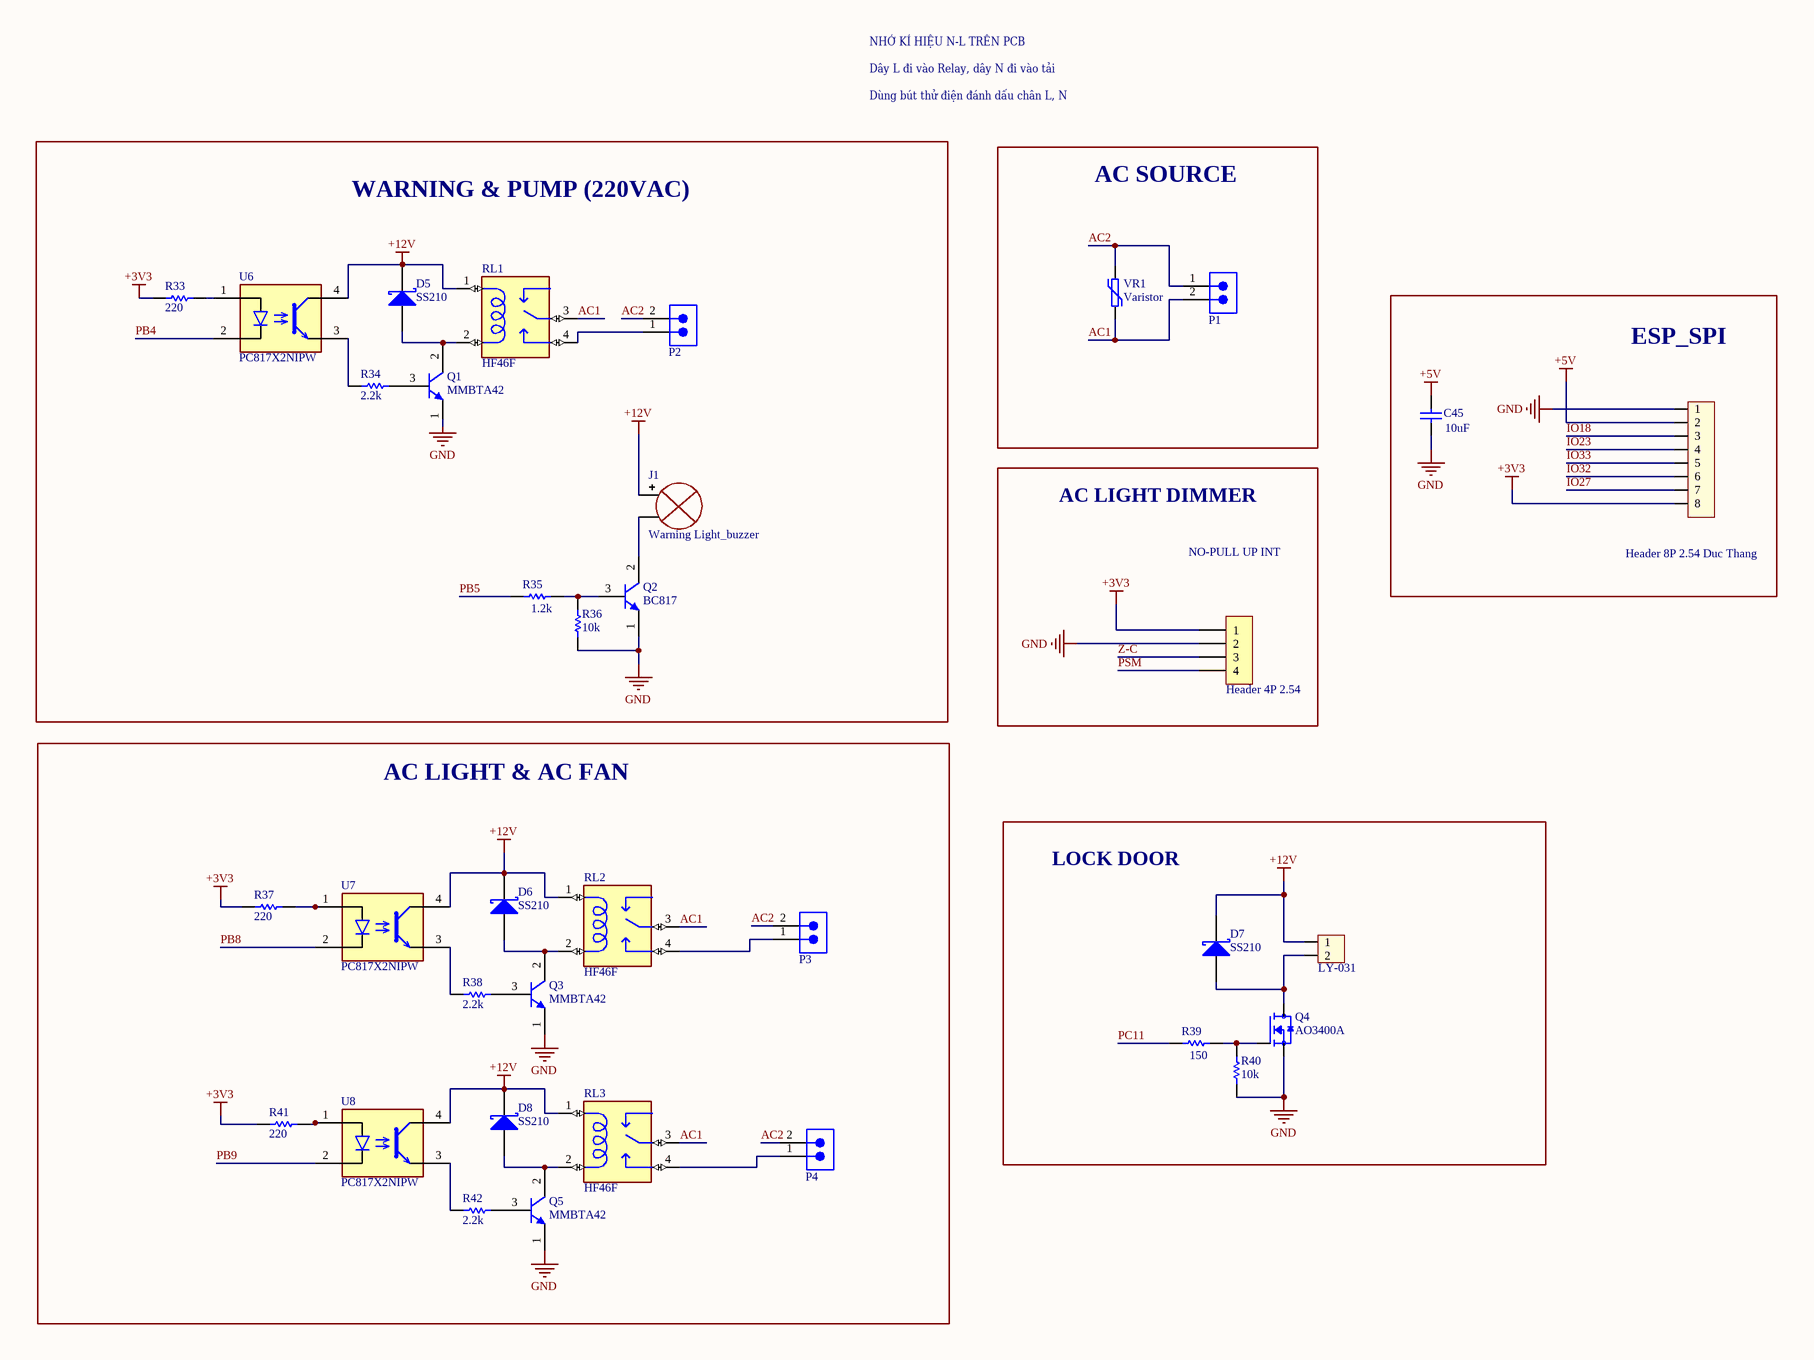
[diagram p4: DEVICE.SchDoc, left]
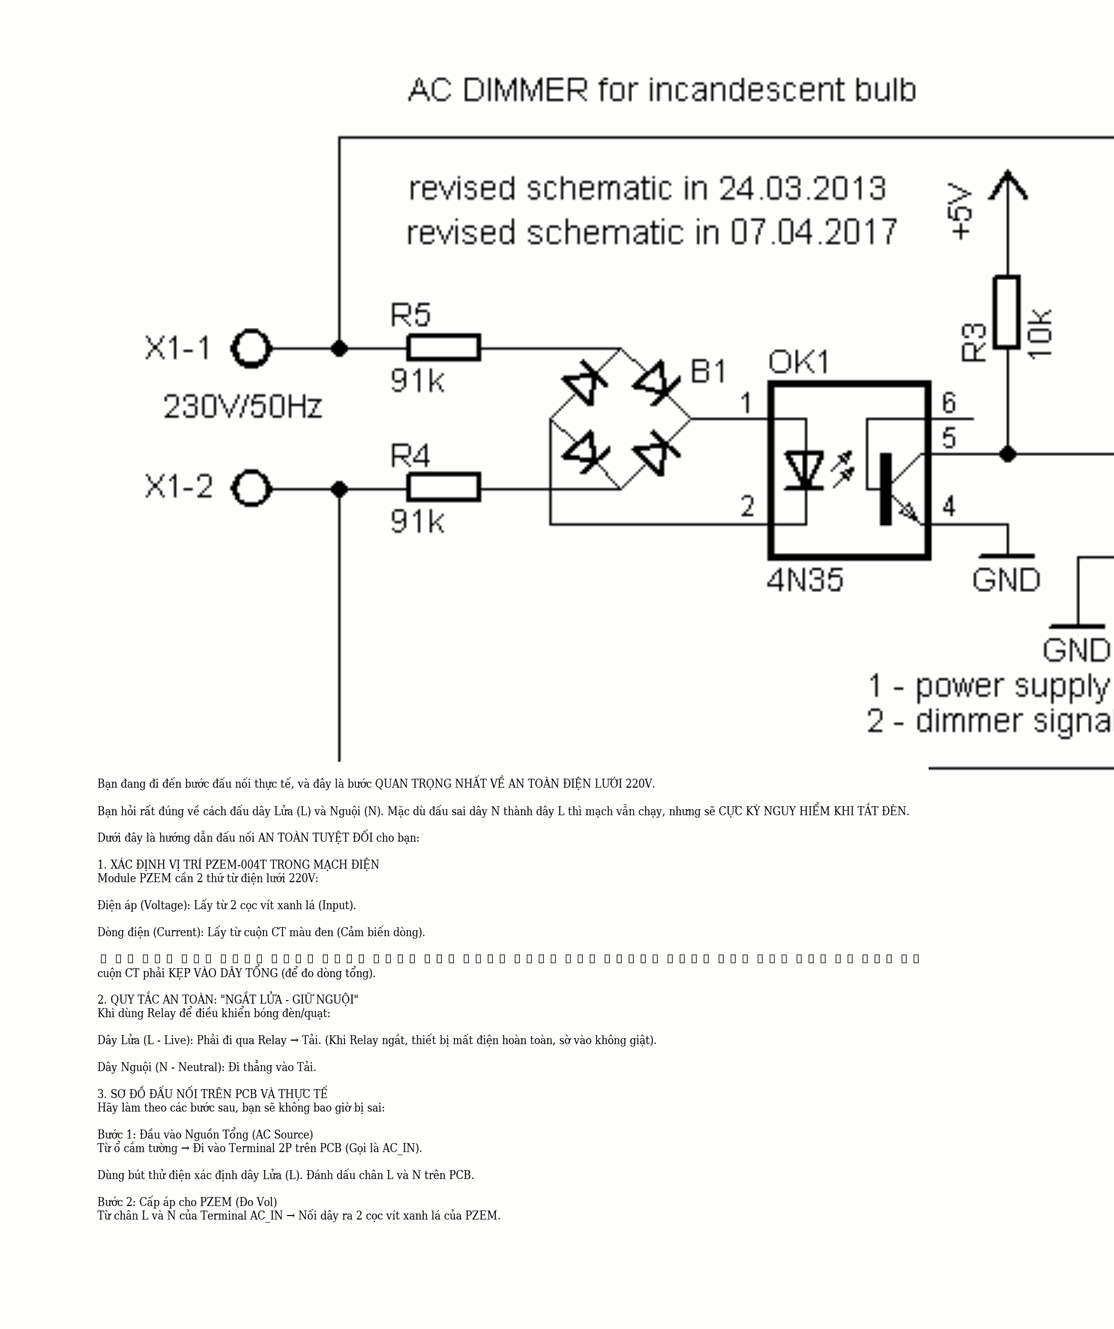
[diagram p5: DEVICE.SchDoc, middle]
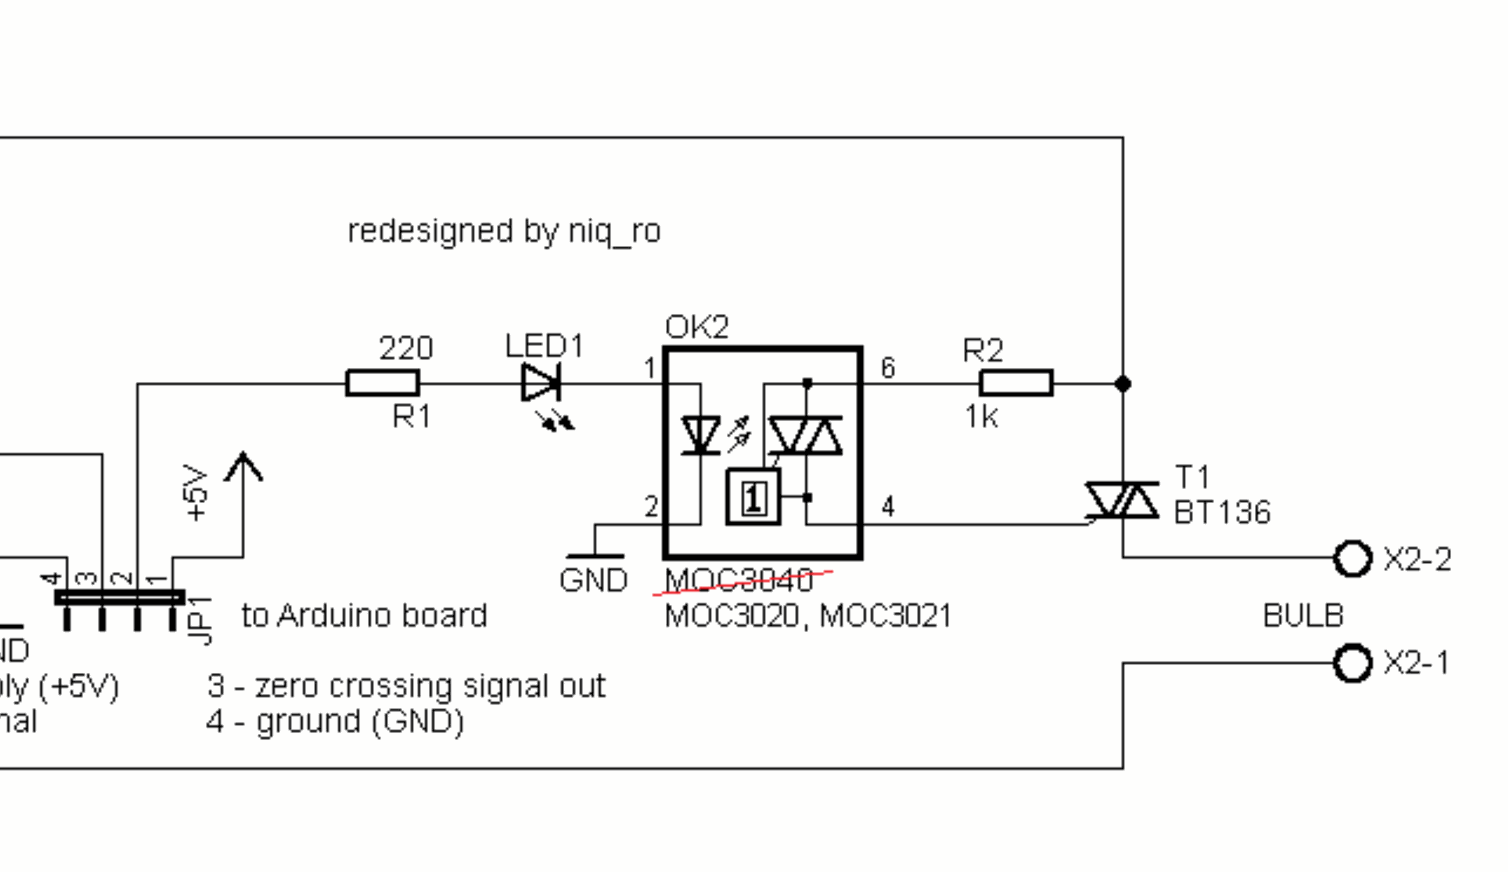
[diagram p6: DEVICE.SchDoc, right]

### Parts
C45  10uF  [CAP_0603]
D5  SS210  [SS34]
D6  SS210  [SS34]
D7  SS210  [SS34]
D8  SS210  [SS34]
H19  Header 8P 2.54 Duc Thang  [XH2.54M-8]
H20  Header 4P 2.54  [XH2.54M-4]
H21  LY-031  [XH2.54M-2]
J1  Warning Light_buzzer  [PHOENIX_1935161]
P1  691322310002  [691322310002]  (value not drawn)
P2  691322310002  [691322310002]  (value not drawn)
P3  691322310002  [691322310002]  (value not drawn)
P4  691322310002  [691322310002]  (value not drawn)
Q1  MMBTA42  [SOT23B]
Q2  BC817  [SOT23B]
Q3  MMBTA42  [SOT23B]
Q4  AO3400A  [SOT95P280X125-3N]
Q5  MMBTA42  [SOT23B]
R33  220  [resistor_0603]
R34  2.2k  [resistor_0603]
R35  1.2k  [resistor_0603]
R36  10k  [resistor_0603]
R37  220  [resistor_0603]
R38  2.2k  [resistor_0603]
R39  150  [resistor_0603]
R40  10k  [resistor_0603]
R41  220  [resistor_0603]
R42  2.2k  [resistor_0603]
RL1  HF46F  [HF46F]
RL2  HF46F  [HF46F]
RL3  HF46F  [HF46F]
U6  PC817X2NIPW  [PC817XI_SHP]
U7  PC817X2NIPW  [PC817XI_SHP]
U8  PC817X2NIPW  [PC817XI_SHP]
VR1  Varistor  [07D471K]

### Blocks framed on the sheet
WARNING & PUMP (220VAC): D5 J1 P2 Q1 Q2 R33-R36 RL1 U6
AC SOURCE: P1 VR1
ESP_SPI: C45 H19
AC LIGHT DIMMER: H20
AC LIGHT & AC FAN: D6 D8 P3 P4 Q3 Q5 R37 R38 R41 R42 RL2 RL3 U7 U8
LOCK DOOR: D7 H21 Q4 R39 R40

### Nets
+3V3: H19.8 H20.1 R33.1 R37.1 R41.1
+5V: C45.2 H19.2
+12V: D5.2(K) D6.2(K) D7.2(K) D8.2(K) H21.1 J1.1(+) RL1.1(C1) RL2.1(C1) RL3.1(C1) U6.4 U7.4 U8.4
GND: C45.1 H19.1 H20.2 Q1.1(E) Q2.1(E) Q3.1(E) Q4.2(S) Q5.1(E) R36.1 R40.1
AC1: P1.2 RL1.3(C) RL2.3(C) RL3.3(C) VR1.2
AC2: P1.1 P2.2 P3.2 P4.2 VR1.1
IO18: H19.3
IO23: H19.4
IO27: H19.7
IO32: H19.6
IO33: H19.5
PB4: U6.2
PB5: R35.1
PB8: U7.2
PB9: U8.2
PC11: R39.1
PSM: H20.4
Z-C: H20.3
NetD5_1: D5.1(A) Q1.2(C) RL1.2(C2)
NetD6_1: D6.1(A) Q3.2(C) RL2.2(C2)
NetD7_1: D7.1(A) H21.2 Q4.3(D)
NetD8_1: D8.1(A) Q5.2(C) RL3.2(C2)
NetJ1_2: J1.2(-) Q2.2(C)
NetP2_1: P2.1 RL1.4(NO)
NetP3_1: P3.1 RL2.4(NO)
NetP4_1: P4.1 RL3.4(NO)
NetQ1_3: Q1.3(B) R34.2
NetQ2_3: Q2.3(B) R35.2 R36.2
NetQ3_3: Q3.3(B) R38.2
NetQ4_1: Q4.1(G) R39.2 R40.2
NetQ5_3: Q5.3(B) R42.2
NetR33_2: R33.2 U6.1
NetR34_1: R34.1 U6.3
NetR37_2: R37.2 U7.1
NetR38_1: R38.1 U7.3
NetR41_2: R41.2 U8.1
NetR42_1: R42.1 U8.3

### Notes on the sheet
- NHỚ KÍ HIỆU N-L TRÊN PCB
- Dây L đi vào Relay, dây N đi vào tải
- Dùng bút thử điện đánh dấu chân L, N
- NO-PULL UP INT
- Bạn đang đi đến bước đấu nối thực tế, và đây là bước QUAN TRỌNG NHẤT VỀ AN TOÀN ĐIỆN LƯỚI 220V.
  Bạn hỏi rất đúng về cách đấu dây Lửa (L) và Nguội (N). Mặc dù đấu sai dây N thành dây L thì mạch vẫn chạy, nhưng sẽ CỰC KỲ NGUY HIỂM KHI TẮT ĐÈN.
  Dưới đây là hướng dẫn đấu nối AN TOÀN TUYỆT ĐỐI cho bạn:
  1. XÁC ĐỊNH VỊ TRÍ PZEM-004T TRONG MẠCH ĐIỆN
  Module PZEM cần 2 thứ từ điện lưới 220V:
  Điện áp (Voltage): Lấy từ 2 cọc vít xanh lá (Input).
  Dòng điện (Current): Lấy từ cuộn CT màu đen (Cảm biến dòng).
  👉 Vị trí lắp đặt: PZEM phải được đấu SONG SONG với nguồn tổng đầu vào (để đo áp) và cuộn CT phải KẸP VÀO DÂY TỔNG (để đo dòng tổng).
  2. QUY TẮC AN TOÀN: "NGẮT LỬA - GIỮ NGUỘI"
  Khi dùng Relay để điều khiển bóng đèn/quạt:
  Dây Lửa (L - Live): Phải đi qua Relay → Tải. (Khi Relay ngắt, thiết bị mất điện hoàn toàn, sờ vào không giật).
  Dây Nguội (N - Neutral): Đi thẳng vào Tải.
  3. SƠ ĐỒ ĐẤU NỐI TRÊN PCB VÀ THỰC TẾ
  Hãy làm theo các bước sau, bạn sẽ không bao giờ bị sai:
  Bước 1: Đầu vào Nguồn Tổng (AC Source)
  Từ ổ cắm tường → Đi vào Terminal 2P trên PCB (Gọi là AC_IN).
  Dùng bút thử điện xác định dây Lửa (L). Đánh dấu chân L và N trên PCB.
  Bước 2: Cấp áp cho PZEM (Đo Vol)
  Từ chân L và N của Terminal AC_IN → Nối dây ra 2 cọc vít xanh lá của PZEM.
  (Lưu ý: PZEM cần đo điện áp nguồn vào, nên nó phải lấy điện TRƯỚC khi đi qua Relay).
  Bước 3: Đo dòng bằng CT (Quan trọng)
  Luồn dây nào? Bạn luồn dây LỬA (L) hay dây NGUỘI (N) qua lỗ cuộn CT đều được. Kết quả đo là như nhau.
  Vị trí luồn:
  Để đo tổng công suất cả nhà: Luồn dây L (hoặc N) từ nguồn tổng đi vào PCB qua lỗ CT.
  Mẹo: Bạn có thể luồn ngay đoạn dây điện nguồn trước khi nó chui vào Terminal AC_IN.
  Bước 4: Đấu Relay (Tải)
  Dây Lửa (L): Từ Terminal AC_IN → Chân COM của Relay.
  Đầu ra Relay: Từ chân NO của Relay → Đi ra bóng đèn.
  Dây Nguội (N): Từ Terminal AC_IN → Đi thẳng ra bóng đèn (Không qua Relay).
- Title:
- Desc:
- Designed by:
- Checked by:
- Date:
- Document No:
- Revision:
- Size:
- A3
- Approved by:
- Sheet
- of

### Library data of the parts
C45 = 01060310010: as C9 on sheet POWER SUPPLY; ComponentLink1Description: Manufacturer; ComponentLink1URL: *; ComponentLink2Description: Datasheet; ComponentLink2URL: *; Operating Temperature: -55 to +125degC; Packaging: Tape and Reel; Supply 1 SN: *; Supply 1 name: *; Supply 1 URL: *; Supply 2 SN: *; Supply 2 URL: https://www.thegioiic.com/tu-gom-0603-10uf-16v; Dissipation Factor: *; Height: *; Mounting Technology: SMT; Size: 0603; Capacitance: 10uF; Technical Reference: *
D5-D8 = D Schottky: Schottky Diode; Published: 8-Jun-2000; LatestRevisionDate: 17-Jul-2002; LatestRevisionNote: Re-released for DXP Platform.; PackageReference: SMB; Publisher: Altium Limited; PackageDescription: DO-214-AA/SMB; 2 C-Bend Leads; Body 5.3 x 3.6 mm, inc. leads (LxW); Code_JEDEC: DO-214-AA
H19 = Header 8P 2.54 Duc Thang: as H2 on sheet MCU; Chung_Loai: Cắm
H20 = Header 4P 2.54 Duc Thang: as H1 on sheet MCU; Chung_Loai: Cắm
H21 = Header 2P 2.54 Duc Thang: as H4 on sheet MCU; Chung_Loai: Cắm
J1 = Light_12V
P1-P4 = 691322310002: WR-TBL Series 322 Horizontal PCB Header, THT, pitch 3.81mm, 2p; Manufacturer: Wurth Elektronik; Modularity: No; Rated Current: 10A; Working Voltage: 300V; Supply 3 Name: ThegioiIC; ComponentLink1Description: Website Link; ComponentLink1URL: https://www.we-online.com/redexpert/article/691322310002?ad; ComponentLink2Description: Datasheet Link; ComponentLink2URL: https://www.we-online.com/redexpert/spec/691322310002?ad; Manufacturer Part Number: 691322310002; Category: Terminal Blocks; Match Code: WR-TBL; Mount: Through Hole; Operating Temperature Max: 105°C; Operating Temperature Min: -40°C; Packaging: Box; Application: Pluggable; Number of Pins: 2; Number of Rows: 1; Orientation: Horizontal; Pitch: 3.81mm; Supply 1 Name: *; Supply 1 SN: *; Supply 1 URL: *; Supply 2 Name: *; Supply 2 SN: *; Supply 2 URL: *; Supply 3 SN: *; Supply 3 URL 1: https://www.thegioiic.com/kf-3-81-2-r-terminal-block-plug-in-han-pcb-2-chan-cong-3-81mm-300v-10a; Supply 3 URL 2: https://www.thegioiic.com/ul-3-81-2-r-terminal-block-plug-in-han-pcb-2-chan-cong-3-81mm-300v-10a-ulo
Q1-Q3 Q5 = BC817: NPN Bipolar Transistor
Q4 = AO3400A: N-Channel 30 V 5.7A (Ta) 1.4W (Ta) Surface Mount SOT-23-3; MF: Alpha & Omega Semiconductor; SnapEDA_Link: https://www.snapeda.com/parts/AO3400A/Alpha/view-part/?ref=snap; Package: SOT-23 Alpha &amp; Omega Semiconductor Inc.; Value: *; MP: AO3400A; Check_prices: https://www.snapeda.com/parts/AO3400A/Alpha/view-part/?ref=eda
R33 R37 R41 = 0006032211: RES, 220 Ohm, size 0603, 1%; Resistance Tolerant: +/-1%; Rated Power: 1/4W; Supply 1 Name: Mouser; Supply 1 SN: 667-ERJ-UP3F2200V; Supply 2 Name: Digikey; Supply 2 SN: 10-ERJ-UP3F2200VTR-ND 10-ERJ-UP3F2200VCT-ND 10-ERJ-UP3F2200VDKR-ND; Resistance: 220; Size: 0603; Mounting Technology: SMT; ComponentLink1Description: Datasheet link; ComponentLink1URL: https://api.pim.na.industrial.panasonic.com/file_stream/main/fileversion/4484; ComponentLink2Description: Supply 1 URL; ComponentLink2URL: https://www.mouser.vn/ProductDetail/Panasonic/ERJ-UP3F2200V?qs=sGAEpiMZZMvdGkrng054twq3eZrCFN89E%252BhCXuCu3h8RslmTO1I28Q%3D%3D; ComponentLink3Description: Supply 2 URL; ComponentLink3URL: https://www.digikey.com/en/products/detail/panasonic-electronic-components/ERJ-UP3F2200V/12092129
R34 R38 R42 = 0006032221: RES, 2.2k Ohm, size 0603, 1%; Resistance Tolerant: +/-1%; Rated Power: 1/4W; Supply 1 Name: Mouser; Supply 1 SN: 667-ERJ-UP3F2201V; Supply 2 Name: Digikey; Supply 2 SN: 10-ERJ-UP3F2201VTR-ND 10-ERJ-UP3F2201VCT-ND 10-ERJ-UP3F2201VDKR-ND; Supply 3 Name: thegioiic; Supply 3 SN: NA; Resistance: 2.2k; Size: 0603; Mounting Technology: SMT; ComponentLink1Description: Datasheet link; ComponentLink1URL: https://api.pim.na.industrial.panasonic.com/file_stream/main/fileversion/4484; ComponentLink2Description: Supply 1 URL; ComponentLink2URL: https://www.mouser.vn/ProductDetail/Panasonic/ERJ-UP3F2201V?qs=sGAEpiMZZMvdGkrng054twq3eZrCFN89KeaXYJ5LTWyJgfuuVVfZrw%3D%3D; ComponentLink3Description: Supply 2 URL; ComponentLink3URL: https://www.digikey.com/en/products/detail/panasonic-electronic-components/ERJ-UP3F2201V/12092708; ComponentLink4Description: Supply 3 URL; ComponentLink4URL: https://www.thegioiic.com/dien-tro-2-2-kohm-0603-1
R35 = 0006032221: RES, 1.2k Ohm, size 0603, 1%; Resistance: 2.2k; Resistance Tolerant: +/-1%; Rated Power: 1/4W; Supply 1 Name: Mouser; Supply 1 SN: 667-ERJ-UP3F2201V; Supply 2 Name: Digikey; Supply 2 SN: 10-ERJ-UP3F2201VTR-ND 10-ERJ-UP3F2201VCT-ND 10-ERJ-UP3F2201VDKR-ND; Supply 3 Name: thegioiic; Supply 3 SN: NA; Size: 0603; Mounting Technology: SMT; ComponentLink1Description: Datasheet link; ComponentLink1URL: https://api.pim.na.industrial.panasonic.com/file_stream/main/fileversion/4484; ComponentLink2Description: Supply 1 URL; ComponentLink2URL: https://www.mouser.vn/ProductDetail/Panasonic/ERJ-UP3F2201V?qs=sGAEpiMZZMvdGkrng054twq3eZrCFN89KeaXYJ5LTWyJgfuuVVfZrw%3D%3D; ComponentLink3Description: Supply 2 URL; ComponentLink3URL: https://www.digikey.com/en/products/detail/panasonic-electronic-components/ERJ-UP3F2201V/12092708; ComponentLink4Description: Supply 3 URL; ComponentLink4URL: https://www.thegioiic.com/dien-tro-2-2-kohm-0603-1
R36 R40 = 0006032221: RES, 10k Ohm, size 0603, 1%; Resistance: 2.2k; Resistance Tolerant: +/-1%; Rated Power: 1/4W; Supply 1 Name: Mouser; Supply 1 SN: 667-ERJ-UP3F2201V; Supply 2 Name: Digikey; Supply 2 SN: 10-ERJ-UP3F2201VTR-ND 10-ERJ-UP3F2201VCT-ND 10-ERJ-UP3F2201VDKR-ND; Supply 3 Name: thegioiic; Supply 3 SN: NA; Size: 0603; Mounting Technology: SMT; ComponentLink1Description: Datasheet link; ComponentLink1URL: https://api.pim.na.industrial.panasonic.com/file_stream/main/fileversion/4484; ComponentLink2Description: Supply 1 URL; ComponentLink2URL: https://www.mouser.vn/ProductDetail/Panasonic/ERJ-UP3F2201V?qs=sGAEpiMZZMvdGkrng054twq3eZrCFN89KeaXYJ5LTWyJgfuuVVfZrw%3D%3D; ComponentLink3Description: Supply 2 URL; ComponentLink3URL: https://www.digikey.com/en/products/detail/panasonic-electronic-components/ERJ-UP3F2201V/12092708; ComponentLink4Description: Supply 3 URL; ComponentLink4URL: https://www.thegioiic.com/dien-tro-2-2-kohm-0603-1
R39 = 0006032221: RES, 150 Ohm, size 0603, 1%; Resistance: 2.2k; Resistance Tolerant: +/-1%; Rated Power: 1/4W; Supply 1 Name: Mouser; Supply 1 SN: 667-ERJ-UP3F2201V; Supply 2 Name: Digikey; Supply 2 SN: 10-ERJ-UP3F2201VTR-ND 10-ERJ-UP3F2201VCT-ND 10-ERJ-UP3F2201VDKR-ND; Supply 3 Name: thegioiic; Supply 3 SN: NA; Size: 0603; Mounting Technology: SMT; ComponentLink1Description: Datasheet link; ComponentLink1URL: https://api.pim.na.industrial.panasonic.com/file_stream/main/fileversion/4484; ComponentLink2Description: Supply 1 URL; ComponentLink2URL: https://www.mouser.vn/ProductDetail/Panasonic/ERJ-UP3F2201V?qs=sGAEpiMZZMvdGkrng054twq3eZrCFN89KeaXYJ5LTWyJgfuuVVfZrw%3D%3D; ComponentLink3Description: Supply 2 URL; ComponentLink3URL: https://www.digikey.com/en/products/detail/panasonic-electronic-components/ERJ-UP3F2201V/12092708; ComponentLink4Description: Supply 3 URL; ComponentLink4URL: https://www.thegioiic.com/dien-tro-2-2-kohm-0603-1
RL1-RL3 = HF46F: SeriesHF46F 12V 1 Form A 1A Gold Plated SUBMINIATURE INTERMEDIATE POWER RELAY; MF: Hongfa; Package: None; Price: None; Value: *; SnapEDA_Link: https://www.snapeda.com/parts/HF46F/Hongfa/view-part/?ref=snap; MP: HF46F; Availability: Not in stock; Check_prices: https://www.snapeda.com/parts/HF46F/Hongfa/view-part/?ref=eda
U6-U8 = PC817X2NIPW: PC817 series, SMD, I_F (max) = 500mA, V_F (max) = 1.4V. / Breakdown voltage: BV_CE = 80V, BV_BE = 6V.
VR1 = 07D471K 470V

## Nets that join several sheets
+3V3: POWER SUPPLY (C4.2 C5.2 U1.2 U1.4), MCU (38 pins), DEVICE (5 pins)
+5V: POWER SUPPLY (8 pins), MCU (17 pins), DEVICE (C45.2 H19.2)
+12V: POWER SUPPLY (9 pins), MCU (C15.2 U3.1), DEVICE (12 pins)
GND: POWER SUPPLY (23 pins), MCU (60 pins), DEVICE (10 pins)
IO18: MCU (U5.J3-9), DEVICE (H19.3)
IO23: MCU (U5.J3-2), DEVICE (H19.4)
IO27: MCU (U5.J2-11), DEVICE (H19.7)
IO32: MCU (U5.J2-7), DEVICE (H19.6)
IO33: MCU (U5.J2-8), DEVICE (H19.5)
PB4: MCU (U4.56), DEVICE (U6.2)
PB5: MCU (U4.57), DEVICE (R35.1)
PB8: MCU (U4.61), DEVICE (U7.2)
PB9: MCU (U4.62), DEVICE (U8.2)
PC11: MCU (U4.52), DEVICE (R39.1)
PSM: MCU (U4.55), DEVICE (H20.4)
Z-C: MCU (U4.54), DEVICE (H20.3)